# Altium project CtlQFP.PrjPcb (part 1 of 2)
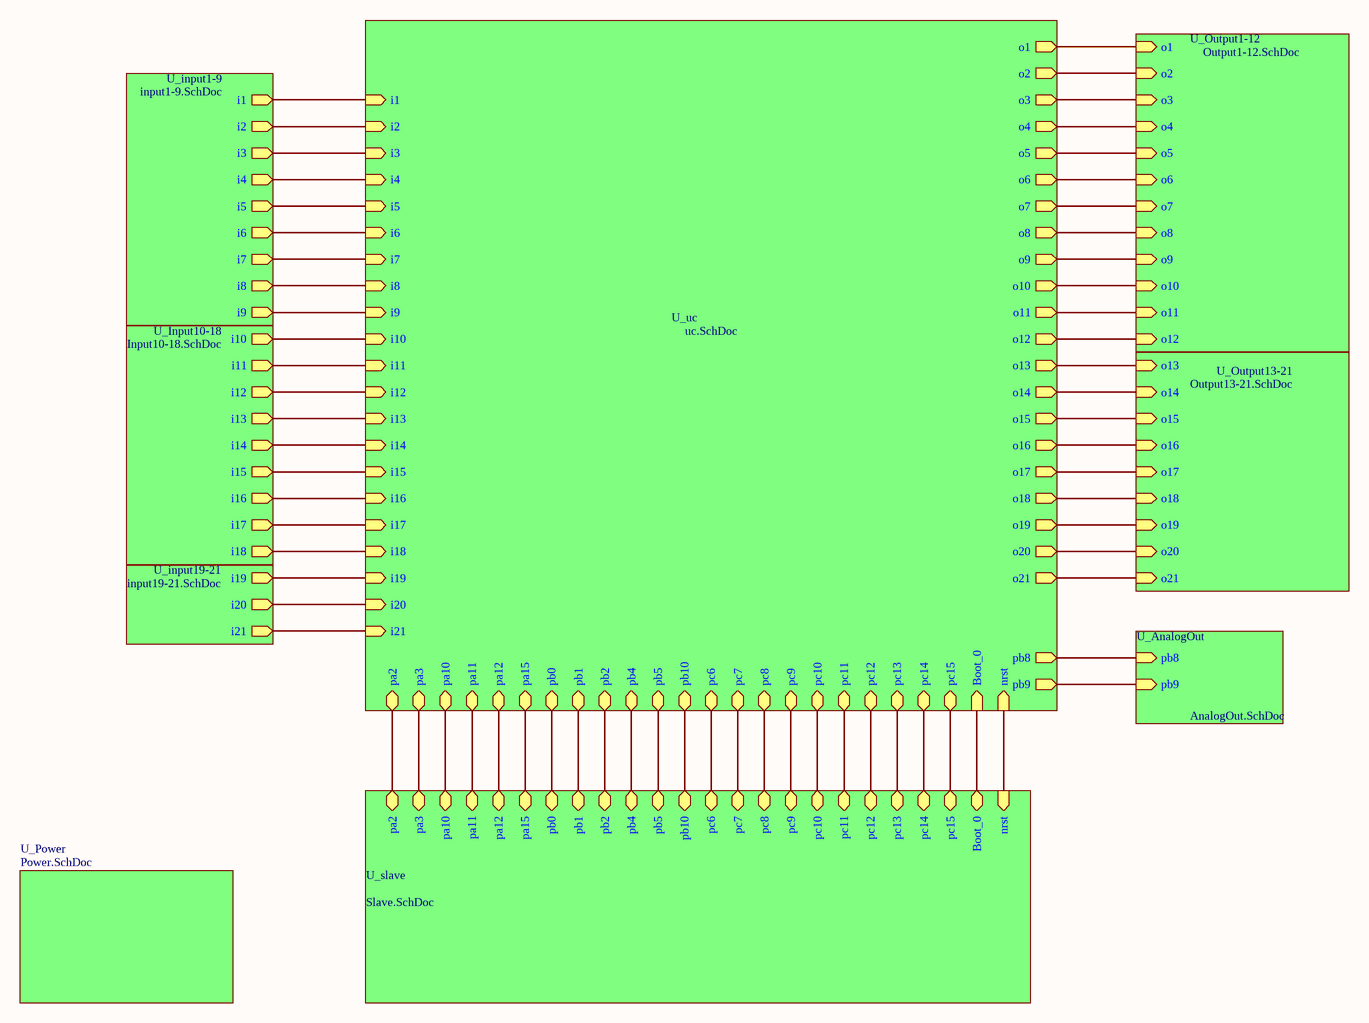
[diagram p0: Main.SchDoc]
10 sheets, 414 parts. Net scope: hierarchical (ports join the sheet entries above them; power ports are global).
Board file: QFP.PcbDoc
Sheets:
  Main.SchDoc
    U_input1-9 = input1-9.SchDoc
    U_Input10-18 = Input10-18.SchDoc
    U_input19-21 = input19-21.SchDoc
    U_AnalogOut = AnalogOut.SchDoc
    U_slave = slave.SchDoc
    U_uc = uc.SchDoc
    U_Power = Power.SchDoc
    U_Output1-12 = Output1-12.SchDoc
    U_Output13-21 = Output13-21.SchDoc

## Sheet Main.SchDoc
size 420 x 297 mm; Revision: 0; SheetNumber: 1; SheetTotal: 10; Номер листа: 1; Общее количество листов: 10; Наименование изделия 1: QFP Main; Наименование изделия 2: Схема электрическая; Наименование изделия 3: принципиальная

### Sub-sheets
U_AnalogOut = AnalogOut.SchDoc: pb8 (in), pb9 (in)
U_input1-9 = input1-9.SchDoc: i2 (out), i3 (out), i1 (out), i5 (out), i6 (out), i4 (out), i8 (out), i9 (out), i7 (out)
U_Input10-18 = Input10-18.SchDoc: i17 (out), i18 (out), i16 (out), i14 (out), i15 (out), i13 (out), i11 (out), i12 (out), i10 (out)
U_input19-21 = input19-21.SchDoc: i20 (out), i21 (out), i19 (out)
U_Output1-12 = Output1-12.SchDoc: o1 (in), o2 (in), o3 (in), o4 (in), o5 (in), o6 (in), o7 (in), o8 (in), o9 (in), o10 (in), o11 (in), o12 (in)
U_Output13-21 = Output13-21.SchDoc: o13 (in), o14 (in), o15 (in), o16 (in), o17 (in), o18 (in), o19 (in), o20 (in), o21 (in)
U_Power = Power.SchDoc: no entries
U_slave = Slave.SchDoc: pa10 (bidir), pa11 (bidir), pa12 (bidir), pa15 (bidir), pb0 (bidir), pb1 (bidir), pb2 (bidir), pb4 (bidir), pb5 (bidir), pb10 (bidir), pс6 (bidir), pс7 (bidir), pс8 (bidir), pс9 (bidir), pс10 (bidir), pс11 (bidir), pс12 (bidir), pс13 (bidir), pс14 (bidir), pс15 (bidir), Вооt_0 (bidir), nrst (in), pa3 (bidir), pa2 (bidir)
U_uc = uc.SchDoc: Вооt_0 (in), nrst (in), i1 (in), i2 (in), i3 (in), i4 (in), i5 (in), i6 (in), i7 (in), i8 (in), i9 (in), i10 (in), i11 (in), i12 (in), i13 (in), i14 (in), i15 (in), i16 (in), i17 (in), i18 (in), i19 (in), i20 (in), i21 (in), pb8 (out), o2 (out), o3 (out), o4 (out), o5 (out), o6 (out), o7 (out), o8 (out), o9 (out), o10 (out), o11 (out), o12 (out), o13 (out), o14 (out), o15 (out), o16 (out), o17 (out), o18 (out), o19 (out), o20 (out), o21 (out), pa10 (bidir), pa11 (bidir), pa12 (bidir), pa15 (bidir), pb0 (bidir), pb1 (bidir), pb2 (bidir), pb4 (bidir), pb10 (bidir), pс6 (bidir), pс7 (bidir), pс8 (bidir), pс9 (bidir), pс10 (bidir), pс11 (bidir), pс12 (bidir), pс13 (bidir), pс14 (bidir), pс15 (bidir), pa3 (bidir), pa2 (bidir), pb9 (out), o1 (out), pb5 (bidir)

### Nets
nrst: sheet U_slave/nrst, sheet U_uc/nrst
NetDD1_10: sheet U_input1-9/i4, sheet U_uc/i4
NetDD1_12: sheet U_input1-9/i3, sheet U_uc/i3
NetDD1_14: sheet U_input1-9/i2, sheet U_uc/i2
NetDD1_16: sheet U_input1-9/i1, sheet U_uc/i1
NetDD2_10: sheet U_input1-9/i8, sheet U_uc/i8
NetDD2_12: sheet U_input1-9/i7, sheet U_uc/i7
NetDD2_14: sheet U_input1-9/i6, sheet U_uc/i6
NetDD2_16: sheet U_input1-9/i5, sheet U_uc/i5
NetDD3_10: sheet U_Input10-18/i12, sheet U_uc/i12
NetDD3_12: sheet U_Input10-18/i11, sheet U_uc/i11
NetDD3_14: sheet U_Input10-18/i10, sheet U_uc/i10
NetDD3_16: sheet U_input1-9/i9, sheet U_uc/i9
NetDD4_10: sheet U_Input10-18/i16, sheet U_uc/i16
NetDD4_12: sheet U_Input10-18/i15, sheet U_uc/i15
NetDD4_14: sheet U_Input10-18/i14, sheet U_uc/i14
NetDD4_16: sheet U_Input10-18/i13, sheet U_uc/i13
NetDD5_10: sheet U_input19-21/i20, sheet U_uc/i20
NetDD5_12: sheet U_input19-21/i19, sheet U_uc/i19
NetDD5_14: sheet U_Input10-18/i18, sheet U_uc/i18
NetDD5_16: sheet U_Input10-18/i17, sheet U_uc/i17
NetDD6_1: sheet U_uc/o1, sheet U_Output1-12/o1
NetDD6_2: sheet U_uc/o2, sheet U_Output1-12/o2
NetDD6_3: sheet U_uc/o3, sheet U_Output1-12/o3
NetDD6_4: sheet U_uc/o4, sheet U_Output1-12/o4
NetDD6_5: sheet U_uc/o5, sheet U_Output1-12/o5
NetDD6_6: sheet U_uc/o6, sheet U_Output1-12/o6
NetDD6_7: sheet U_uc/o7, sheet U_Output1-12/o7
NetDD6_8: sheet U_uc/o8, sheet U_Output1-12/o8
NetDD7_1: sheet U_uc/o9, sheet U_Output1-12/o9
NetDD7_2: sheet U_uc/o10, sheet U_Output1-12/o10
NetDD7_3: sheet U_uc/o11, sheet U_Output1-12/o11
NetDD7_4: sheet U_uc/o12, sheet U_Output1-12/o12
NetDD7_5: sheet U_uc/o13, sheet U_Output13-21/o13
NetDD7_6: sheet U_uc/o14, sheet U_Output13-21/o14
NetDD7_7: sheet U_uc/o15, sheet U_Output13-21/o15
NetDD7_8: sheet U_uc/o16, sheet U_Output13-21/o16
NetDD8_7: sheet U_slave/pс13, sheet U_uc/pс13
NetDD8_8: sheet U_slave/pс14, sheet U_uc/pс14
NetDD8_9: sheet U_slave/pс15, sheet U_uc/pс15
NetDD8_24: sheet U_uc/o17, sheet U_Output13-21/o17
NetDD8_25: sheet U_slave/pa2, sheet U_uc/pa2
NetDD8_26: sheet U_slave/pa3, sheet U_uc/pa3
NetDD8_31: sheet U_uc/o18, sheet U_Output13-21/o18
NetDD8_32: sheet U_uc/o19, sheet U_Output13-21/o19
NetDD8_34: sheet U_input19-21/i21, sheet U_uc/i21
NetDD8_35: sheet U_slave/pb0, sheet U_uc/pb0
NetDD8_36: sheet U_slave/pb1, sheet U_uc/pb1
NetDD8_37: sheet U_slave/pb2, sheet U_uc/pb2
NetDD8_47: sheet U_slave/pb10, sheet U_uc/pb10
NetDD8_63: sheet U_slave/pс6, sheet U_uc/pс6
NetDD8_64: sheet U_slave/pс7, sheet U_uc/pс7
NetDD8_65: sheet U_slave/pс8, sheet U_uc/pс8
NetDD8_66: sheet U_slave/pс9, sheet U_uc/pс9
NetDD8_67: sheet U_uc/o20, sheet U_Output13-21/o20
NetDD8_68: sheet U_uc/o21, sheet U_Output13-21/o21
NetDD8_69: sheet U_slave/pa10, sheet U_uc/pa10
NetDD8_70: sheet U_slave/pa11, sheet U_uc/pa11
NetDD8_71: sheet U_slave/pa12, sheet U_uc/pa12
NetDD8_77: sheet U_slave/pa15, sheet U_uc/pa15
NetDD8_78: sheet U_slave/pс10, sheet U_uc/pс10
NetDD8_79: sheet U_slave/pс11, sheet U_uc/pс11
NetDD8_80: sheet U_slave/pс12, sheet U_uc/pс12
NetDD8_90: sheet U_slave/pb4, sheet U_uc/pb4
NetDD8_91: sheet U_slave/pb5, sheet U_uc/pb5
NetDD8_94: sheet U_slave/Вооt_0, sheet U_uc/Вооt_0
NetDD8_95: sheet U_AnalogOut/pb8, sheet U_uc/pb8
NetDD8_96: sheet U_AnalogOut/pb9, sheet U_uc/pb9

### Notes on the sheet
- Перв. примен.
- Справ. №
- Подп. и дата
- Инв. № дубл.
- Взам. инв. №
- Разраб.
- Изм.
- Лист
- № докум.
- Подп.
- Дата
- Лит.
- Масса
- Масштаб
- Пров.
- Т.контр.
- Листов
- Инв. № подл.
- Утв.
- Н.контр.
- Копировал
- Формат А3

## Sheet input1-9.SchDoc
size 594 x 420 mm; Обозначение документа: QFP input1-9; Номер листа: 4; Общее количество листов: 9
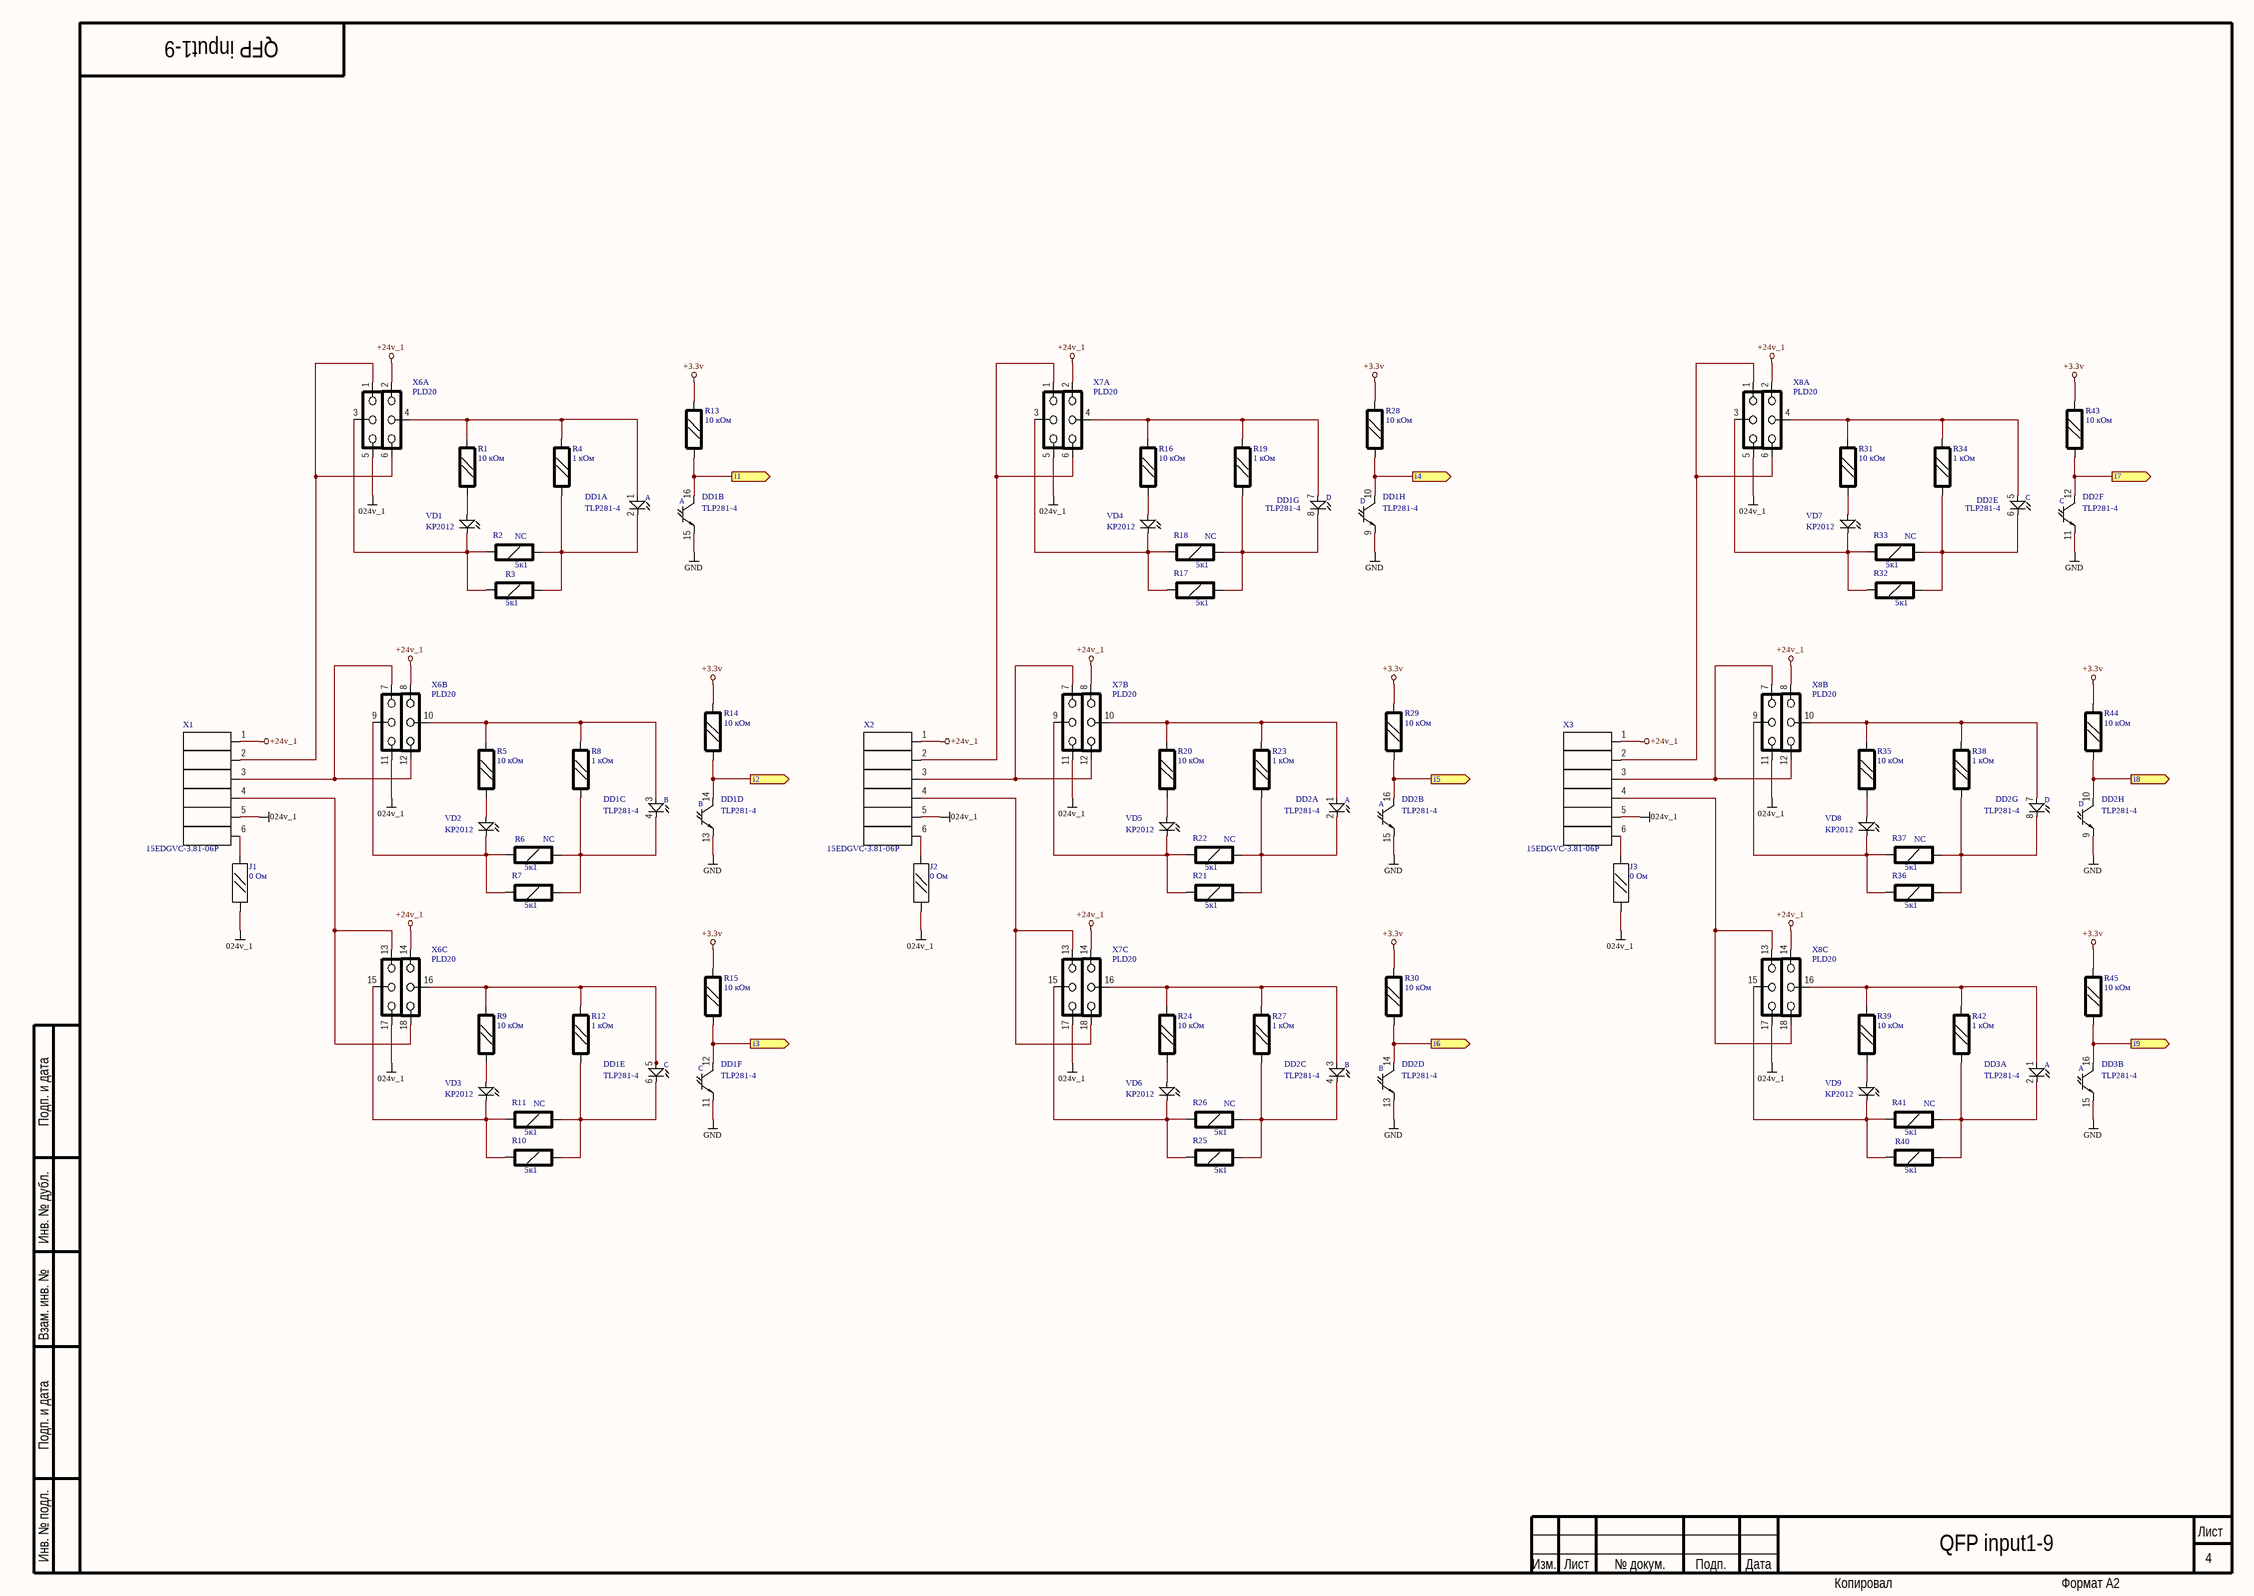
[diagram p1: input1-9.SchDoc]

### Parts
DD1  TLP281-4  [SO16]  (parts A,B,C,D,E,F,G,H of 8)
DD2  TLP281-4  [SO16]  (parts A,B,C,D,E,F,G,H of 8)
DD3  TLP281-4  [SO16]  (parts A,B of 8)
J1  0 Ом  [SMD0805RES]
J2  0 Ом  [SMD0805RES]
J3  0 Ом  [SMD0805RES]
R1  10 кОм  [SMD0805RES]
R2  5к1  SolderOpton: NC  [RES1206]
R3  5к1  [RES1206]
R4  1 кОм  [SMD0805RES]
R5  10 кОм  [SMD0805RES]
R6  5к1  SolderOpton: NC  [RES1206]
R7  5к1  [RES1206]
R8  1 кОм  [SMD0805RES]
R9  10 кОм  [SMD0805RES]
R10  5к1  [RES1206]
R11  5к1  SolderOpton: NC  [RES1206]
R12  1 кОм  [SMD0805RES]
R13  10 кОм  [SMD0805RES]
R14  10 кОм  [SMD0805RES]
R15  10 кОм  [SMD0805RES]
R16  10 кОм  [SMD0805RES]
R17  5к1  [RES1206]
R18  5к1  SolderOpton: NC  [RES1206]
R19  1 кОм  [SMD0805RES]
R20  10 кОм  [SMD0805RES]
R21  5к1  [RES1206]
R22  5к1  SolderOpton: NC  [RES1206]
R23  1 кОм  [SMD0805RES]
R24  10 кОм  [SMD0805RES]
R25  5к1  [RES1206]
R26  5к1  SolderOpton: NC  [RES1206]
R27  1 кОм  [SMD0805RES]
R28  10 кОм  [SMD0805RES]
R29  10 кОм  [SMD0805RES]
R30  10 кОм  [SMD0805RES]
R31  10 кОм  [SMD0805RES]
R32  5к1  [RES1206]
R33  5к1  SolderOpton: NC  [RES1206]
R34  1 кОм  [SMD0805RES]
R35  10 кОм  [SMD0805RES]
R36  5к1  [RES1206]
R37  5к1  SolderOpton: NC  [RES1206]
R38  1 кОм  [SMD0805RES]
R39  10 кОм  [SMD0805RES]
R40  5к1  [RES1206]
R41  5к1  SolderOpton: NC  [RES1206]
R42  1 кОм  [SMD0805RES]
R43  10 кОм  [SMD0805RES]
R44  10 кОм  [SMD0805RES]
R45  10 кОм  [SMD0805RES]
VD1  KP2012  [SMD0805DIO_C]
VD2  KP2012  [SMD0805DIO_C]
VD3  KP2012  [SMD0805DIO_C]
VD4  KP2012  [SMD0805DIO_C]
VD5  KP2012  [SMD0805DIO_C]
VD6  KP2012  [SMD0805DIO_C]
VD7  KP2012  [SMD0805DIO_C]
VD8  KP2012  [SMD0805DIO_C]
VD9  KP2012  [SMD0805DIO_C]
X1  15EDGVC-3.81-06P  [15EDGVC_081_6]
X2  15EDGVC-3.81-06P  [15EDGVC_081_6]
X3  15EDGVC-3.81-06P  [15EDGVC_081_6]
X6  PLD20  [pld2x10_1.27]  (parts A,B,C of 7)
X7  PLD20  [pld2x10_1.27]  (parts A,B,C of 7)
X8  PLD20  [pld2x10_1.27]  (parts A,B,C of 7)

### Ports
i1 (out), i2 (out), i3 (out), i4 (out), i5 (out), i6 (out), i7 (out), i8 (out), i9 (out)

### Nets
024v_1: J1.1 J2.2 J3.2 X1.5 X2.5 X3.5 X6.5 X6.11 X6.17 X7.5 X7.11 X7.17 X8.5 X8.11 X8.17
+3.3v: R13.2 R14.2 R15.2 R28.2 R29.2 R30.2 R43.2 R44.2 R45.2
+24v_1: X1.1 X2.1 X3.1 X6.2 X6.8 X6.14 X7.2 X7.8 X7.14 X8.2 X8.8 X8.14
GND: DD1.9(Emitter_D) DD1.11(Emitter_C) DD1.13(Emitter_B) DD1.15(Emitter_A) DD2.9(Emitter_D) DD2.11(Emitter_C) DD2.13(Emitter_B) DD2.15(Emitter_A) DD3.15(Emitter_A)
NetDD1_1: DD1.1(Anode_A) R1.1 R4.1 X6.4
NetDD1_2: DD1.2(Cathode_A) R2.2 R3.2 R4.2
NetDD1_3: DD1.3(Anode_B) R5.1 R8.1 X6.10
NetDD1_4: DD1.4(Cathode_B) R6.2 R7.2 R8.2
NetDD1_5: DD1.5(Anode_C) R9.1 R12.1 X6.16
NetDD1_6: DD1.6(Cathode) R10.2 R11.2 R12.2
NetDD1_7: DD1.7(Anode_D) R16.1 R19.1 X7.4
NetDD1_8: DD1.8(Cathode_D) R17.2 R18.2 R19.2
NetDD1_10: DD1.10(Collector_D) R28.1 ; port i4
NetDD1_12: DD1.12(Collector_C) R15.1 ; port i3
NetDD1_14: DD1.14(Collector_B) R14.1 ; port i2
NetDD1_16: DD1.16(Collector_A) R13.1 ; port i1
NetDD2_1: DD2.1(Anode_A) R20.1 R23.1 X7.10
NetDD2_2: DD2.2(Cathode_A) R21.2 R22.2 R23.2
NetDD2_3: DD2.3(Anode_B) R24.1 R27.1 X7.16
NetDD2_4: DD2.4(Cathode_B) R25.2 R26.2 R27.2
NetDD2_5: DD2.5(Anode_C) R31.1 R34.1 X8.4
NetDD2_6: DD2.6(Cathode) R32.2 R33.2 R34.2
NetDD2_7: DD2.7(Anode_D) R35.1 R38.1 X8.10
NetDD2_8: DD2.8(Cathode_D) R36.2 R37.2 R38.2
NetDD2_10: DD2.10(Collector_D) R44.1 ; port i8
NetDD2_12: DD2.12(Collector_C) R43.1 ; port i7
NetDD2_14: DD2.14(Collector_B) R30.1 ; port i6
NetDD2_16: DD2.16(Collector_A) R29.1 ; port i5
NetDD3_1: DD3.1(Anode_A) R39.1 R42.1 X8.16
NetDD3_2: DD3.2(Cathode_A) R40.2 R41.2 R42.2
NetDD3_16: DD3.16(Collector_A) R45.1 ; port i9
NetJ1_2: J1.2 X1.6
NetJ2_1: J2.1 X2.6
NetJ3_1: J3.1 X3.6
NetR1_2: R1.2 VD1.2(Anode)
NetR2_1: R2.1 R3.1 VD1.1(Cathode) X6.3
NetR5_2: R5.2 VD2.2(Anode)
NetR6_1: R6.1 R7.1 VD2.1(Cathode) X6.9
NetR9_2: R9.2 VD3.2(Anode)
NetR10_1: R10.1 R11.1 VD3.1(Cathode) X6.15
NetR16_2: R16.2 VD4.2(Anode)
NetR17_1: R17.1 R18.1 VD4.1(Cathode) X7.3
NetR20_2: R20.2 VD5.2(Anode)
NetR21_1: R21.1 R22.1 VD5.1(Cathode) X7.9
NetR24_2: R24.2 VD6.2(Anode)
NetR25_1: R25.1 R26.1 VD6.1(Cathode) X7.15
NetR31_2: R31.2 VD7.2(Anode)
NetR32_1: R32.1 R33.1 VD7.1(Cathode) X8.3
NetR35_2: R35.2 VD8.2(Anode)
NetR36_1: R36.1 R37.1 VD8.1(Cathode) X8.9
NetR39_2: R39.2 VD9.2(Anode)
NetR40_1: R40.1 R41.1 VD9.1(Cathode) X8.15
NetX1_2: X1.2 X6.1 X6.6
NetX1_3: X1.3 X6.7 X6.12
NetX1_4: X1.4 X6.13 X6.18
NetX2_2: X2.2 X7.1 X7.6
NetX2_3: X2.3 X7.7 X7.12
NetX2_4: X2.4 X7.13 X7.18
NetX3_2: X3.2 X8.1 X8.6
NetX3_3: X3.3 X8.7 X8.12
NetX3_4: X3.4 X8.13 X8.18

### Notes on the sheet
- Подп. и дата
- Инв. № дубл.
- Взам. инв. №
- Инв. № подл.
- Изм.
- Лист
- № докум.
- Подп.
- Дата
- Копировал
- Формат А2
- (in symbol TLP281-4, part A) A
- (in symbol TLP281-4, part B) A
- (in symbol TLP281-4, part C) B
- (in symbol TLP281-4, part D) B
- (in symbol TLP281-4, part E) C
- (in symbol TLP281-4, part F) C
- (in symbol TLP281-4, part G) D
- (in symbol TLP281-4, part H) D

### Library data of the parts
DD1-DD3 = TLP281-4: 4х канальная транзисторная оптопара; Vendor: Tosba; Voltage: 80V; SolderOptoin: Norm; Value: TLP281-4; Price: 250
J1-J3 = JR0805: SMD 0805 перемычка; SolderOption: Norm; Price: 2; Vendor: *; Value: 0 Ом
R1 R4 R5 R8 R9 R12-R16 R19 R20 R23 R24 R27-R31 R34 R35 R38 R39 R42-R45 = R0805: Чип резистор 0805; Vendor: Generic; Tolerance: 5%; SolderOpton: Norm; Price: 2
  R1 R5 R9 R13-R16 R20 R24 R28-R31 R35 R39 R43-R45: Value: 10 кОм
  R4 R8 R12 R19 R23 R27 R34 R38 R42: Value: 1 кОм
R2 R6 R11 R18 R22 R26 R33 R37 R41 = R1206: Чип резистор 1206; Vendor: Generic; Tolerance: 5%; Price: 2; Value: 5к1
R3 R7 R10 R17 R21 R25 R32 R36 R40 = R1206: Чип резистор 1206; Vendor: Generic; Tolerance: 5%; SolderOpton: Norm; Price: 2; Value: 5к1
VD1-VD9 = KP2012_C: Чип светодиод 0805; Vendor: KB; Color: Green; SolderOpton: Norm; Price: 20; Value: KP2012
X1-X3 = 15EDGVC-3.81-06P: Вилка  6/3.81; Vendor: Degson; Current: 8А; Voltage: 2кВ; Price: 50; Value: 15EDGVC-3.81-06P
X6-X8 = PLD20: Вилка  PLD 20/1.27; Vendor: Confly; SolderOption: Norm; Price: 10; Value: PLD20

## Sheet Input10-18.SchDoc
size 594 x 420 mm; SheetNumber: 5; SheetTotal: 9; Обозначение документа: QFP input10-18; Номер листа: 5; Общее количество листов: 9
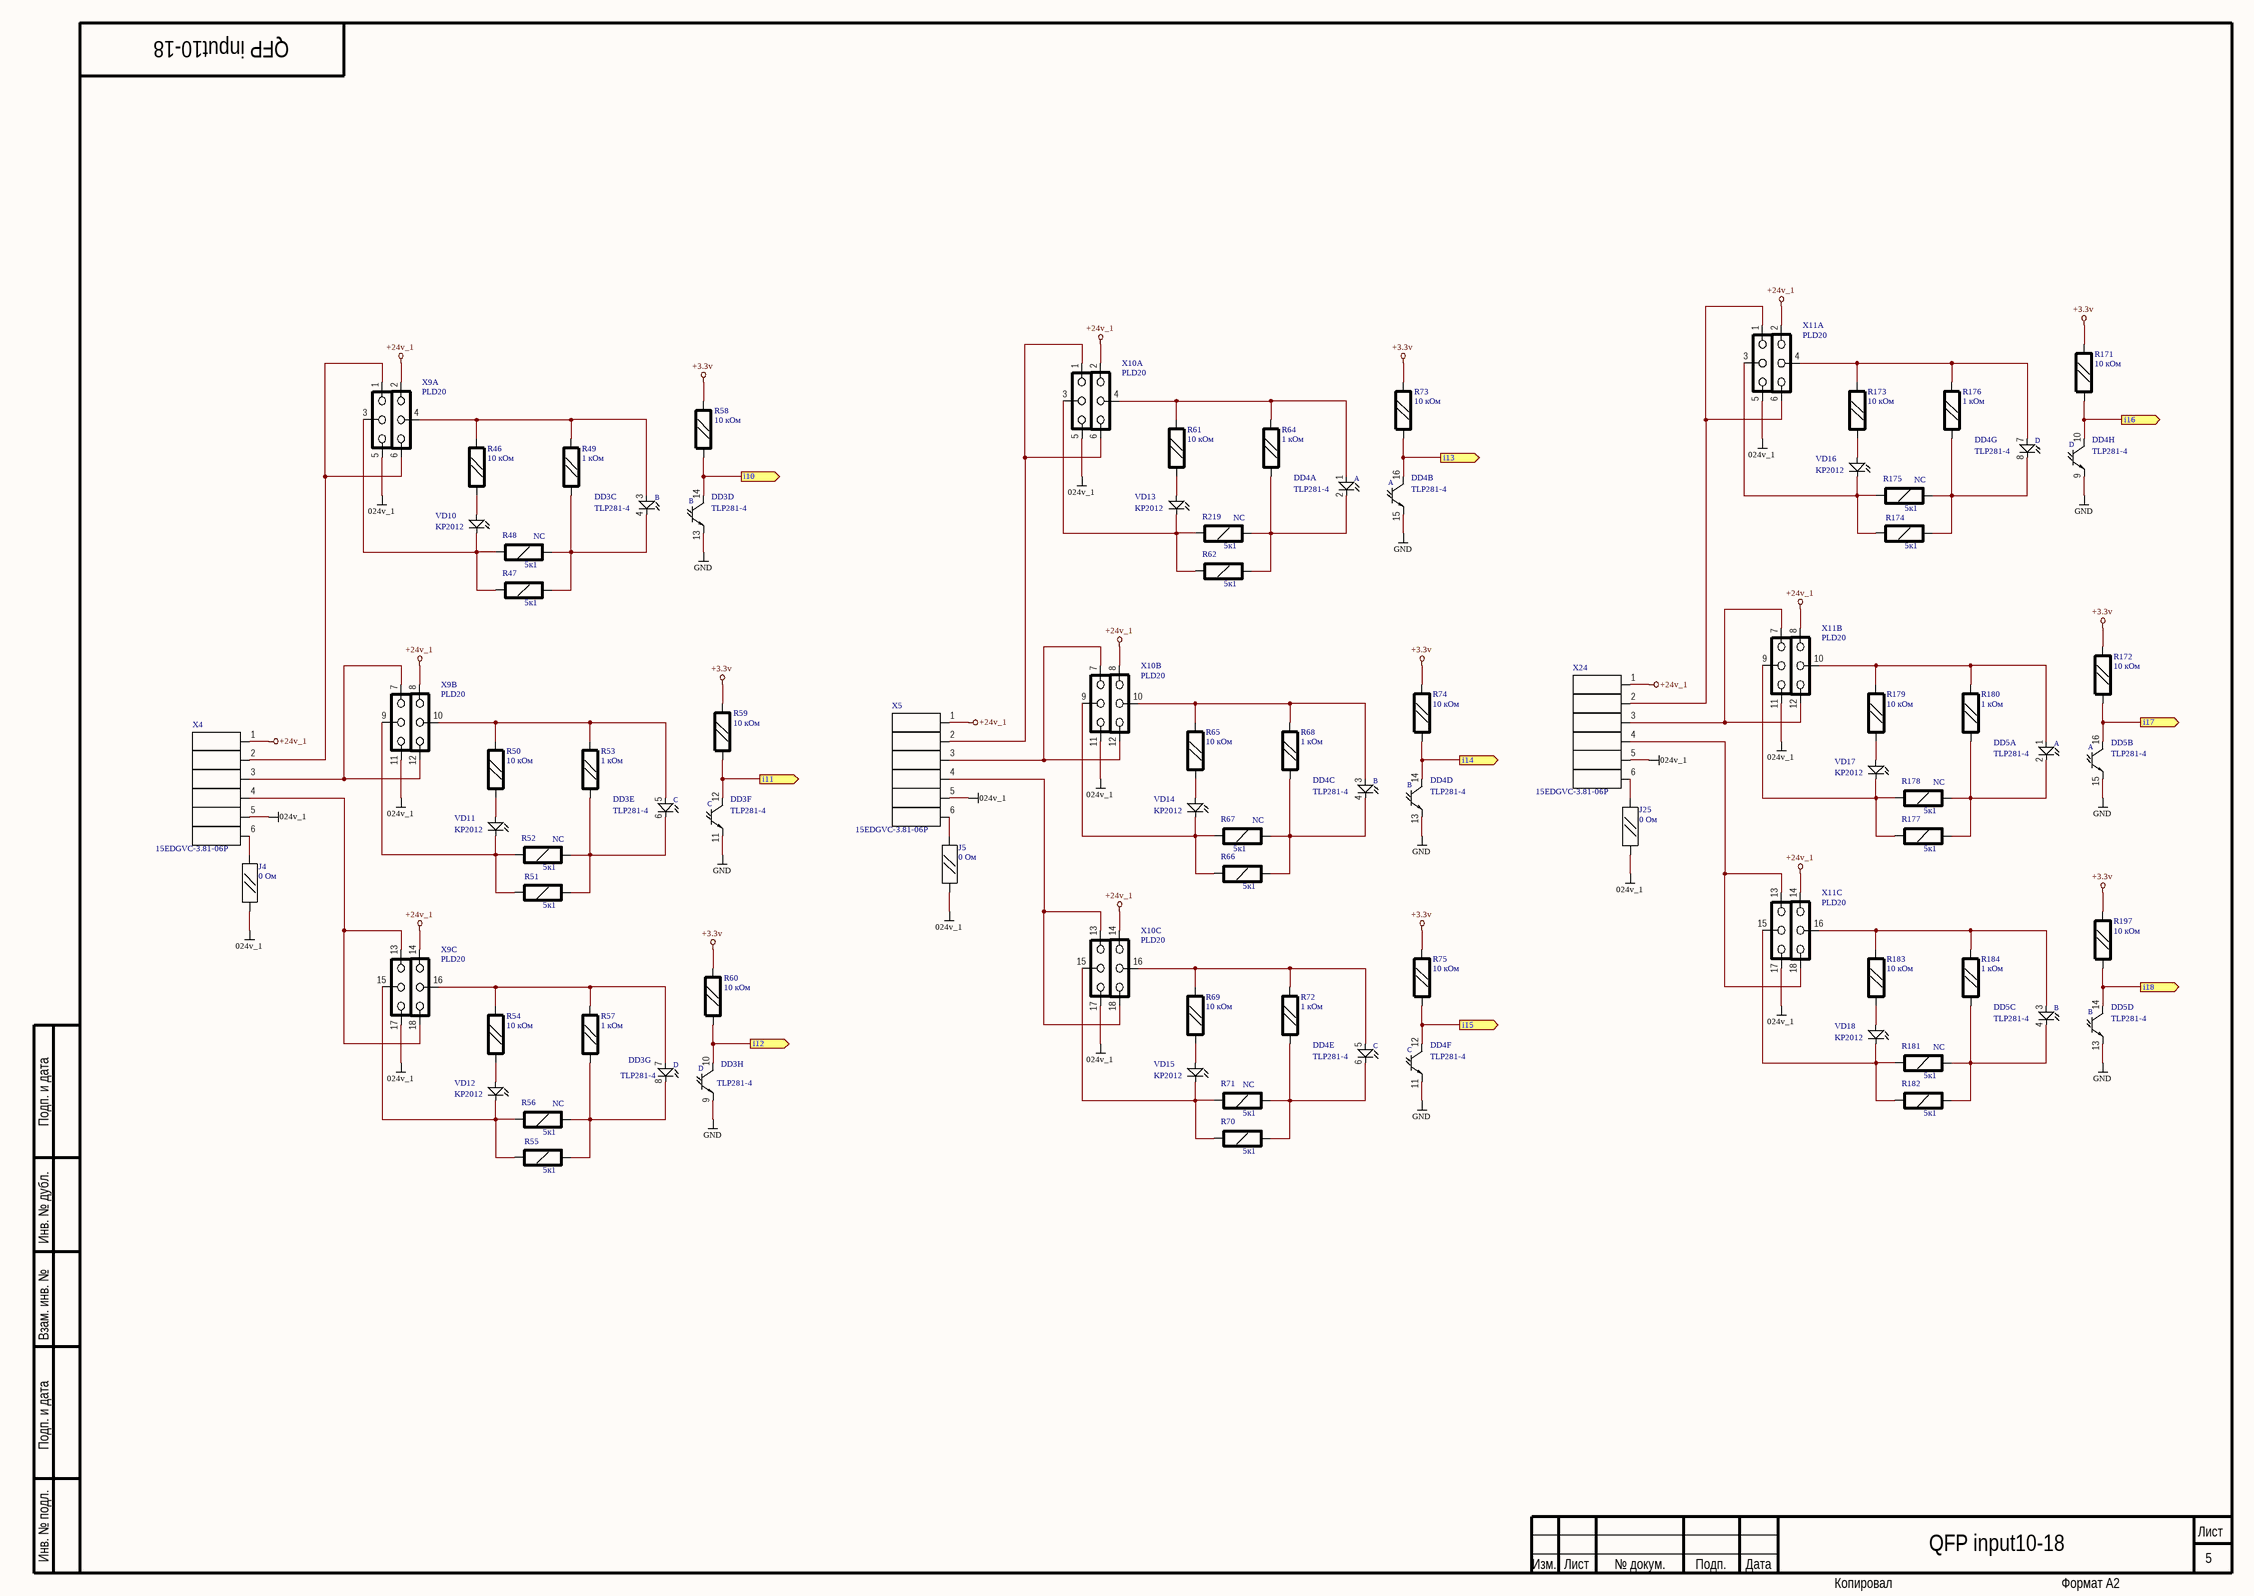
[diagram p2: Input10-18.SchDoc]

### Parts
DD3  TLP281-4  [SO16]  (parts C,D,E,F,G,H of 8)
DD4  TLP281-4  [SO16]  (parts A,B,C,D,E,F,G,H of 8)
DD5  TLP281-4  [SO16]  (parts A,B,C,D of 8)
J4  0 Ом  [SMD0805RES]
J5  0 Ом  [SMD0805RES]
J25  0 Ом  [SMD0805RES]
R46  10 кОм  [SMD0805RES]
R47  5к1  [RES1206]
R48  5к1  SolderOpton: NC  [RES1206]
R49  1 кОм  [SMD0805RES]
R50  10 кОм  [SMD0805RES]
R51  5к1  [RES1206]
R52  5к1  SolderOpton: NC  [RES1206]
R53  1 кОм  [SMD0805RES]
R54  10 кОм  [SMD0805RES]
R55  5к1  [RES1206]
R56  5к1  SolderOpton: NC  [RES1206]
R57  1 кОм  [SMD0805RES]
R58  10 кОм  [SMD0805RES]
R59  10 кОм  [SMD0805RES]
R60  10 кОм  [SMD0805RES]
R61  10 кОм  [SMD0805RES]
R62  5к1  [RES1206]
R64  1 кОм  [SMD0805RES]
R65  10 кОм  [SMD0805RES]
R66  5к1  [RES1206]
R67  5к1  SolderOpton: NC  [RES1206]
R68  1 кОм  [SMD0805RES]
R69  10 кОм  [SMD0805RES]
R70  5к1  [RES1206]
R71  5к1  SolderOpton: NC  [RES1206]
R72  1 кОм  [SMD0805RES]
R73  10 кОм  [SMD0805RES]
R74  10 кОм  [SMD0805RES]
R75  10 кОм  [SMD0805RES]
R171  10 кОм  [SMD0805RES]
R172  10 кОм  [SMD0805RES]
R173  10 кОм  [SMD0805RES]
R174  5к1  [RES1206]
R175  5к1  SolderOpton: NC  [RES1206]
R176  1 кОм  [SMD0805RES]
R177  5к1  [RES1206]
R178  5к1  SolderOpton: NC  [RES1206]
R179  10 кОм  [SMD0805RES]
R180  1 кОм  [SMD0805RES]
R181  5к1  SolderOpton: NC  [RES1206]
R182  5к1  [RES1206]
R183  10 кОм  [SMD0805RES]
R184  1 кОм  [SMD0805RES]
R197  10 кОм  [SMD0805RES]
R219  5к1  SolderOpton: NC  [RES1206]
VD10  KP2012  [SMD0805DIO_C]
VD11  KP2012  [SMD0805DIO_C]
VD12  KP2012  [SMD0805DIO_C]
VD13  KP2012  [SMD0805DIO_C]
VD14  KP2012  [SMD0805DIO_C]
VD15  KP2012  [SMD0805DIO_C]
VD16  KP2012  [SMD0805DIO_C]
VD17  KP2012  [SMD0805DIO_C]
VD18  KP2012  [SMD0805DIO_C]
X4  15EDGVC-3.81-06P  [15EDGVC_081_6]
X5  15EDGVC-3.81-06P  [15EDGVC_081_6]
X9  PLD20  [pld2x10_1.27]  (parts A,B,C of 7)
X10  PLD20  [pld2x10_1.27]  (parts A,B,C of 7)
X11  PLD20  [pld2x10_1.27]  (parts A,B,C of 7)
X24  15EDGVC-3.81-06P  [15EDGVC_081_6]

### Ports
i10 (out), i11 (out), i12 (out), i13 (out), i14 (out), i15 (out), i16 (out), i17 (out), i18 (out)

### Nets
024v_1: J4.2 J5.2 J25.2 X4.5 X5.5 X9.5 X9.11 X9.17 X10.5 X10.11 X10.17 X11.5 X11.11 X11.17 X24.5
+3.3v: R58.2 R59.2 R60.2 R73.2 R74.2 R75.2 R171.2 R172.2 R197.2
+24v_1: X4.1 X5.1 X9.2 X9.8 X9.14 X10.2 X10.8 X10.14 X11.2 X11.8 X11.14 X24.1
GND: DD3.9(Emitter_D) DD3.11(Emitter_C) DD3.13(Emitter_B) DD4.9(Emitter_D) DD4.11(Emitter_C) DD4.13(Emitter_B) DD4.15(Emitter_A) DD5.13(Emitter_B) DD5.15(Emitter_A)
NetDD3_3: DD3.3(Anode_B) R46.1 R49.1 X9.4
NetDD3_4: DD3.4(Cathode_B) R47.2 R48.2 R49.2
NetDD3_5: DD3.5(Anode_C) R50.1 R53.1 X9.10
NetDD3_6: DD3.6(Cathode) R51.2 R52.2 R53.2
NetDD3_7: DD3.7(Anode_D) R54.1 R57.1 X9.16
NetDD3_8: DD3.8(Cathode_D) R55.2 R56.2 R57.2
NetDD3_10: DD3.10(Collector_D) R60.1 ; port i12
NetDD3_12: DD3.12(Collector_C) R59.1 ; port i11
NetDD3_14: DD3.14(Collector_B) R58.1 ; port i10
NetDD4_1: DD4.1(Anode_A) R61.1 R64.1 X10.4
NetDD4_2: DD4.2(Cathode_A) R62.2 R64.2 R219.2
NetDD4_3: DD4.3(Anode_B) R65.1 R68.1 X10.10
NetDD4_4: DD4.4(Cathode_B) R66.2 R67.2 R68.2
NetDD4_5: DD4.5(Anode_C) R69.1 R72.1 X10.16
NetDD4_6: DD4.6(Cathode) R70.2 R71.2 R72.2
NetDD4_7: DD4.7(Anode_D) R173.1 R176.1 X11.4
NetDD4_8: DD4.8(Cathode_D) R174.2 R175.2 R176.2
NetDD4_10: DD4.10(Collector_D) R171.1 ; port i16
NetDD4_12: DD4.12(Collector_C) R75.1 ; port i15
NetDD4_14: DD4.14(Collector_B) R74.1 ; port i14
NetDD4_16: DD4.16(Collector_A) R73.1 ; port i13
NetDD5_1: DD5.1(Anode_A) R179.1 R180.1 X11.10
NetDD5_2: DD5.2(Cathode_A) R177.2 R178.2 R180.2
NetDD5_3: DD5.3(Anode_B) R183.1 R184.1 X11.16
NetDD5_4: DD5.4(Cathode_B) R181.2 R182.2 R184.2
NetDD5_14: DD5.14(Collector_B) R197.1 ; port i18
NetDD5_16: DD5.16(Collector_A) R172.1 ; port i17
NetJ4_1: J4.1 X4.6
NetJ5_1: J5.1 X5.6
NetJ25_1: J25.1 X24.6
NetR46_2: R46.2 VD10.2(Anode)
NetR47_1: R47.1 R48.1 VD10.1(Cathode) X9.3
NetR50_2: R50.2 VD11.2(Anode)
NetR51_1: R51.1 R52.1 VD11.1(Cathode) X9.9
NetR54_2: R54.2 VD12.2(Anode)
NetR55_1: R55.1 R56.1 VD12.1(Cathode) X9.15
NetR61_2: R61.2 VD13.2(Anode)
NetR62_1: R62.1 R219.1 VD13.1(Cathode) X10.3
NetR65_2: R65.2 VD14.2(Anode)
NetR66_1: R66.1 R67.1 VD14.1(Cathode) X10.9
NetR69_2: R69.2 VD15.2(Anode)
NetR70_1: R70.1 R71.1 VD15.1(Cathode) X10.15
NetR173_2: R173.2 VD16.2(Anode)
NetR174_1: R174.1 R175.1 VD16.1(Cathode) X11.3
NetR177_1: R177.1 R178.1 VD17.1(Cathode) X11.9
NetR179_2: R179.2 VD17.2(Anode)
NetR181_1: R181.1 R182.1 VD18.1(Cathode) X11.15
NetR183_2: R183.2 VD18.2(Anode)
NetX4_2: X4.2 X9.1 X9.6
NetX4_3: X4.3 X9.7 X9.12
NetX4_4: X4.4 X9.13 X9.18
NetX5_2: X5.2 X10.1 X10.6
NetX5_3: X5.3 X10.7 X10.12
NetX5_4: X5.4 X10.13 X10.18
NetX11_1: X11.1 X11.6 X24.2
NetX11_7: X11.7 X11.12 X24.3
NetX11_13: X11.13 X11.18 X24.4

### Notes on the sheet
- Подп. и дата
- Инв. № дубл.
- Взам. инв. №
- Инв. № подл.
- Изм.
- Лист
- № докум.
- Подп.
- Дата
- Копировал
- Формат А2
- (in symbol TLP281-4, part A) A
- (in symbol TLP281-4, part B) A
- (in symbol TLP281-4, part C) B
- (in symbol TLP281-4, part D) B
- (in symbol TLP281-4, part E) C
- (in symbol TLP281-4, part F) C
- (in symbol TLP281-4, part G) D
- (in symbol TLP281-4, part H) D

### Library data of the parts
DD3-DD5 = TLP281-4: as DD1 on sheet input1-9; Value: TLP281-4; Price: 250
J4 J5 J25 = JR0805: SMD 0805 перемычка; SolderOption: Norm; Price: 2; Vendor: *; Value: 0 Ом
R46 R49 R50 R53 R54 R57-R61 R64 R65 R68 R69 R72-R75 R171-R173 R176 R179 R180 R183 R184 R197 = R0805: as R1 on sheet input1-9; Price: 2
  R46 R50 R54 R58-R61 R65 R69 R73-R75 R171-R173 R179 R183 R197: Value: 10 кОм
  R49 R53 R57 R64 R68 R72 R176 R180 R184: Value: 1 кОм
R47 R51 R55 R62 R66 R70 R174 R177 R182 = R1206: as R3 on sheet input1-9; Price: 2; Value: 5к1
R48 R52 R56 R67 R71 R175 R178 R181 R219 = R1206: as R2 on sheet input1-9; Price: 2; Value: 5к1
VD10-VD18 = KP2012_C: as VD1 on sheet input1-9; Price: 20; Value: KP2012
X4 X5 X24 = 15EDGVC-3.81-06P: as X1 on sheet input1-9; Price: 50; Value: 15EDGVC-3.81-06P
X9-X11 = PLD20: as X6 on sheet input1-9; Price: 10; Value: PLD20

## Sheet input19-21.SchDoc
size 420 x 297 mm; Обозначение документа: QFP input19-21; Номер листа: 6; Общее количество листов: 9
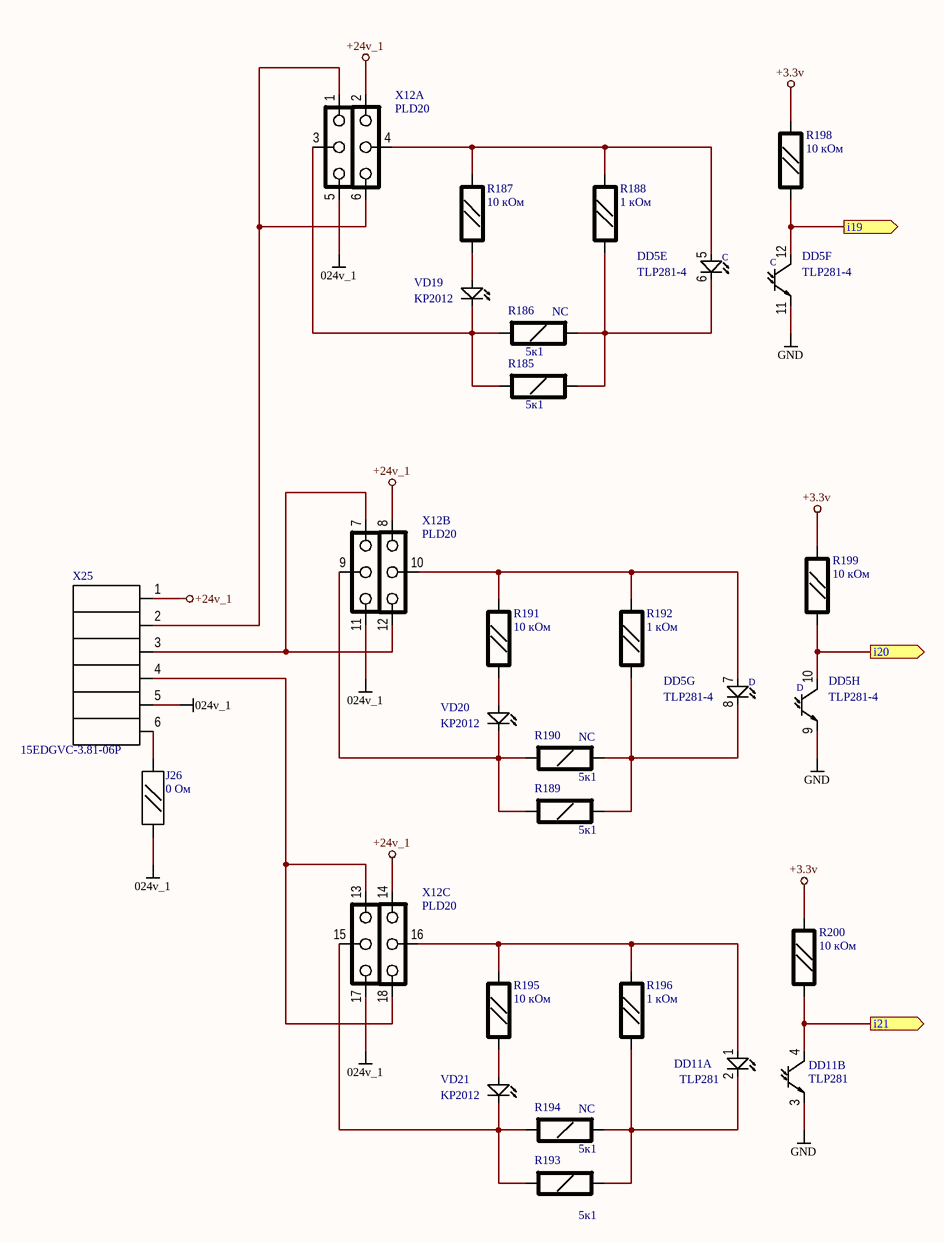
[diagram p3: input19-21.SchDoc]

### Parts
DD5  TLP281-4  [SO16]  (parts E,F,G,H of 8)
DD11  TLP281  [SOIC4]  (parts A,B of 2)
J26  0 Ом  [SMD0805RES]
R185  5к1  [RES1206]
R186  5к1  SolderOpton: NC  [RES1206]
R187  10 кОм  [SMD0805RES]
R188  1 кОм  [SMD0805RES]
R189  5к1  [RES1206]
R190  5к1  SolderOpton: NC  [RES1206]
R191  10 кОм  [SMD0805RES]
R192  1 кОм  [SMD0805RES]
R193  5к1  [RES1206]
R194  5к1  SolderOpton: NC  [RES1206]
R195  10 кОм  [SMD0805RES]
R196  1 кОм  [SMD0805RES]
R198  10 кОм  [SMD0805RES]
R199  10 кОм  [SMD0805RES]
R200  10 кОм  [SMD0805RES]
VD19  KP2012  [SMD0805DIO_C]
VD20  KP2012  [SMD0805DIO_C]
VD21  KP2012  [SMD0805DIO_C]
X12  PLD20  [pld2x10_1.27]  (parts A,B,C of 7)
X25  15EDGVC-3.81-06P  [15EDGVC_081_6]

### Ports
i19 (out), i20 (out), i21 (out)

### Nets
024v_1: J26.2 X12.5 X12.11 X12.17 X25.5
+3.3v: R198.2 R199.2 R200.2
+24v_1: X12.2 X12.8 X12.14 X25.1
GND: DD5.9(Emitter_D) DD5.11(Emitter_C) DD11.3(Emitter)
NetDD5_5: DD5.5(Anode_C) R187.1 R188.1 X12.4
NetDD5_6: DD5.6(Cathode) R185.2 R186.2 R188.2
NetDD5_7: DD5.7(Anode_D) R191.1 R192.1 X12.10
NetDD5_8: DD5.8(Cathode_D) R189.2 R190.2 R192.2
NetDD5_10: DD5.10(Collector_D) R199.1 ; port i20
NetDD5_12: DD5.12(Collector_C) R198.1 ; port i19
NetDD8_34: DD11.4(Collector) R200.1 ; port i21
NetDD11_1: DD11.1(Anode) R195.1 R196.1 X12.16
NetDD11_2: DD11.2(Cathode) R193.2 R194.2 R196.2
NetJ26_1: J26.1 X25.6
NetR185_1: R185.1 R186.1 VD19.1(Cathode) X12.3
NetR187_2: R187.2 VD19.2(Anode)
NetR189_1: R189.1 R190.1 VD20.1(Cathode) X12.9
NetR191_2: R191.2 VD20.2(Anode)
NetR193_1: R193.1 R194.1 VD21.1(Cathode) X12.15
NetR195_2: R195.2 VD21.2(Anode)
NetX12_1: X12.1 X12.6 X25.2
NetX12_7: X12.7 X12.12 X25.3
NetX12_13: X12.13 X12.18 X25.4

### Notes on the sheet
- Подп. и дата
- Инв. № дубл.
- Взам. инв. №
- Инв. № подл.
- Изм.
- Лист
- № докум.
- Подп.
- Дата
- Копировал
- Формат А3
- (in symbol TLP281-4, part E) C
- (in symbol TLP281-4, part F) C
- (in symbol TLP281-4, part G) D
- (in symbol TLP281-4, part H) D

### Library data of the parts
DD5 = TLP281-4: as DD1 on sheet input1-9; Value: TLP281-4; Price: 250
DD11 = TLP281: Оптопара транзисторная; Vendor: Tosba; Voltage: 80V; SolderOption: Norm; Value: TLP281; Price: 150
J26 = JR0805: SMD 0805 перемычка; SolderOption: Norm; Price: 2; Vendor: *; Value: 0 Ом
R185 R189 R193 = R1206: as R3 on sheet input1-9; Price: 2; Value: 5к1
R186 R190 R194 = R1206: as R2 on sheet input1-9; Price: 2; Value: 5к1
R187 R188 R191 R192 R195 R196 R198-R200 = R0805: as R1 on sheet input1-9; Price: 2
  R187 R191 R195 R198-R200: Value: 10 кОм
  R188 R192 R196: Value: 1 кОм
VD19-VD21 = KP2012_C: as VD1 on sheet input1-9; Price: 20; Value: KP2012
X12 = PLD20: as X6 on sheet input1-9; Price: 10; Value: PLD20
X25 = 15EDGVC-3.81-06P: as X1 on sheet input1-9; Price: 50; Value: 15EDGVC-3.81-06P

## Sheet AnalogOut.SchDoc
size 420 x 297 mm; Обозначение документа: QFP analogOut; Номер листа: 9; Общее количество листов: 10
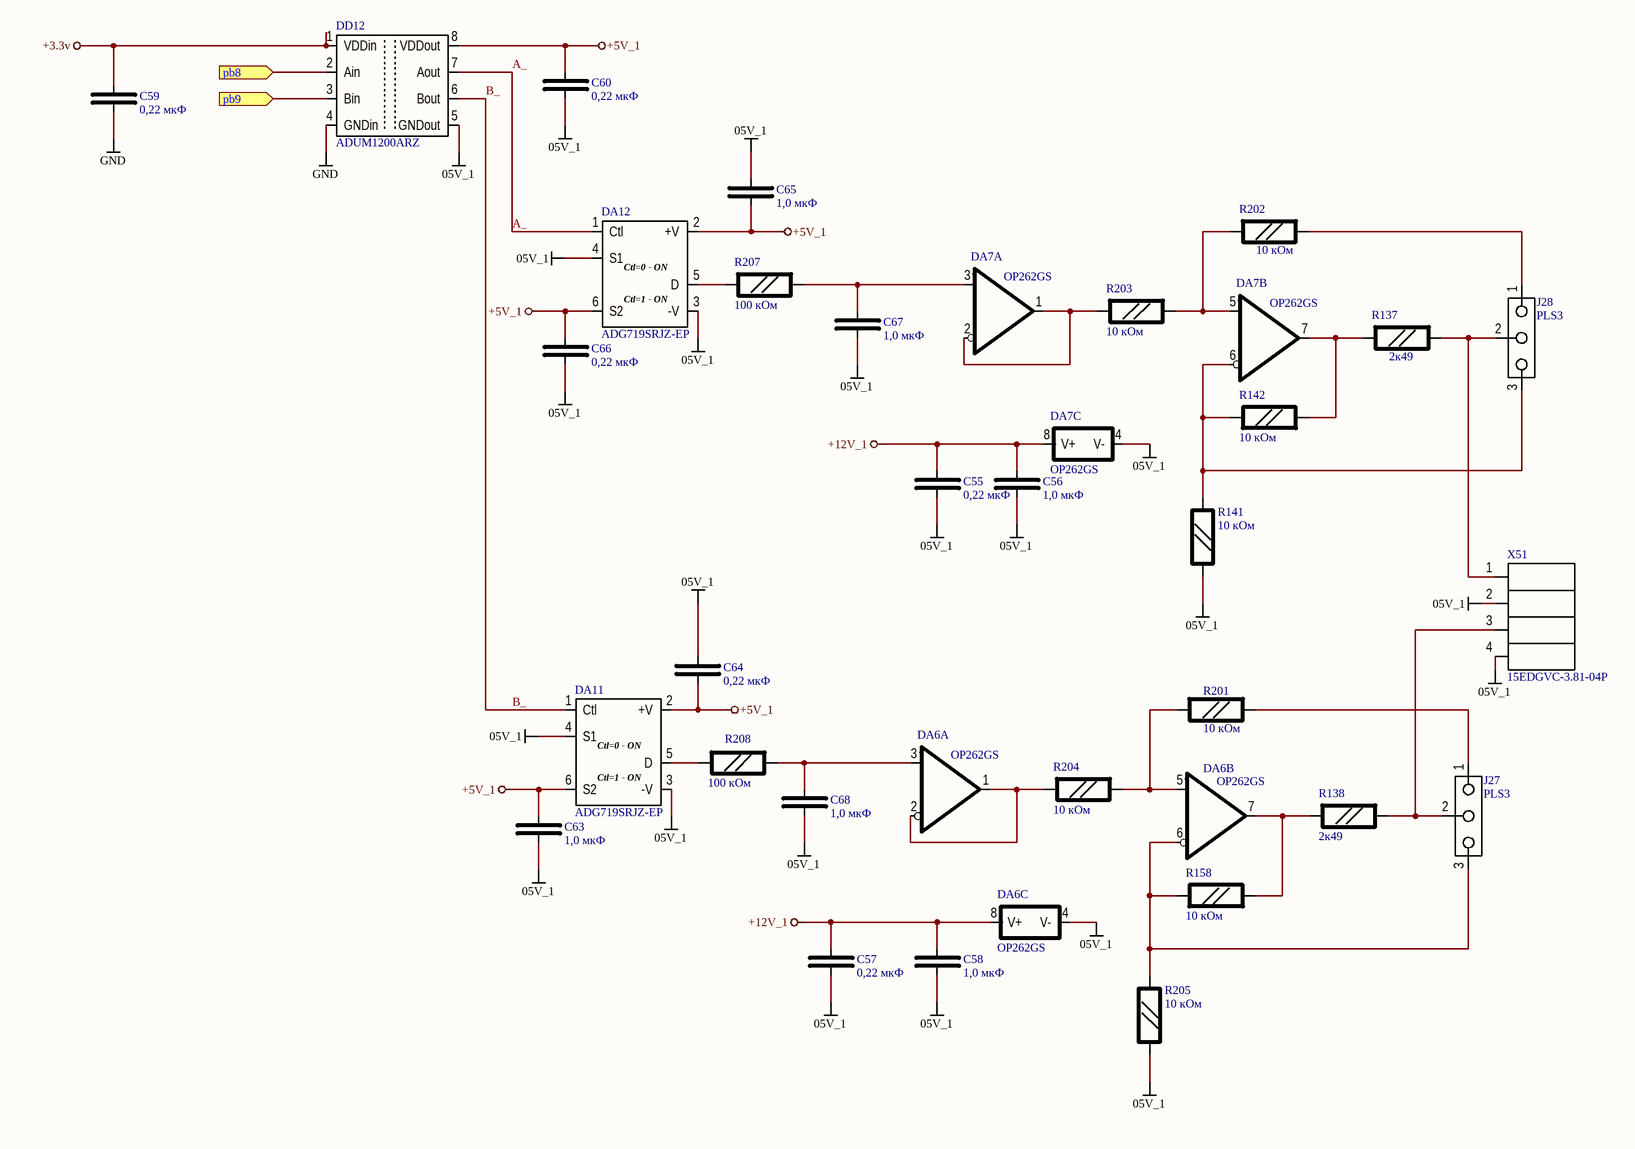
[diagram p4: AnalogOut.SchDoc]

### Parts
C55  0,22 мкФ  [SMD0805CAP]
C56  1,0 мкФ  [SMD0805CAP]
C57  0,22 мкФ  [SMD0805CAP]
C58  1,0 мкФ  [SMD0805CAP]
C59  0,22 мкФ  [SMD0805CAP]
C60  0,22 мкФ  [SMD0805CAP]
C63  1,0 мкФ  [SMD0805CAP]
C64  0,22 мкФ  [SMD0805CAP]
C65  1,0 мкФ  [SMD0805CAP]
C66  0,22 мкФ  [SMD0805CAP]
C67  1,0 мкФ  [SMD0805CAP]
C68  1,0 мкФ  [SMD0805CAP]
DA6  OP262GS  [SO8]  (parts A,B,C of 3)
DA7  OP262GS  [SO8]  (parts A,B,C of 3)
DA11  ADG719SRJZ-EP  [SOT23-6]
DA12  ADG719SRJZ-EP  [SOT23-6]
DD12  ADUM1200ARZ  [SO8]
J27  PLS3  [HDR1X3]
J28  PLS3  [HDR1X3]
R137  2к49  [SMD0805RES]
R138  2к49  [SMD0805RES]
R141  10 кОм  [SMD0805RES]
R142  10 кОм  [SMD0805RES]
R158  10 кОм  [SMD0805RES]
R201  10 кОм  [SMD0805RES]
R202  10 кОм  [SMD0805RES]
R203  10 кОм  [SMD0805RES]
R204  10 кОм  [SMD0805RES]
R205  10 кОм  [SMD0805RES]
R207  100 кОм  [SMD0805RES]
R208  100 кОм  [SMD0805RES]
X51  15EDGVC-3.81-04P  [15EDGVC_081_4]

### Ports
pb8 (in), pb9 (in)

### Nets
05V_1: C55.2 C56.2 C57.2 C58.2 C60.2 C63.2 C64.2 C65.2 C66.2 C67.2 C68.2 DA6.4(V-) DA7.4(V-) DA11.3(-V) DA11.4(S1) DA12.3(-V) DA12.4(S1) DD12.5(GNDout) R141.1 R205.1 X51.2 X51.4
+3.3v: C59.1 DD12.1(VDDin)
+5V_1: C60.1 C63.1 C64.1 C65.1 C66.1 DA11.2(+V) DA11.6(S2) DA12.2(+V) DA12.6(S2) DD12.8(VDDout)
+12V_1: C55.1 C56.1 C57.1 C58.1 DA6.8(V+) DA7.8(V+)
GND: C59.2 DD12.4(GNDin)
A_: DA12.1(Ctl) DD12.7(Aout)
B_: DA11.1(Ctl) DD12.6(Bout)
NetC67_1: C67.1 DA7.3(+) R207.2
NetC68_1: C68.1 DA6.3(+) R208.2
NetDA6_1: DA6.1(OUT) DA6.2(-) R204.1
NetDA6_5: DA6.5(+) R201.1 R204.2
NetDA6_6: DA6.6(-) J27.3(Left) R158.2 R205.2
NetDA6_7: DA6.7(OUT) R138.1 R158.1
NetDA7_1: DA7.1(OUT) DA7.2(-) R203.1
NetDA7_5: DA7.5(+) R202.1 R203.2
NetDA7_6: DA7.6(-) J28.3(Left) R141.2 R142.2
NetDA7_7: DA7.7(OUT) R137.1 R142.1
NetDA11_5: DA11.5(D) R208.1
NetDA12_5: DA12.5(D) R207.1
NetDD8_95: DD12.2(Ain) ; port pb8
NetDD8_96: DD12.3(Bin) ; port pb9
NetJ27_1: J27.1(Right) R201.2
NetJ27_2: J27.2(Cetnter) R138.2 X51.3
NetJ28_1: J28.1(Right) R202.2
NetJ28_2: J28.2(Cetnter) R137.2 X51.1

### Notes on the sheet
- Подп. и дата
- Инв. № дубл.
- Взам. инв. №
- Инв. № подл.
- Изм.
- Лист
- № докум.
- Подп.
- Дата
- Копировал
- Формат А3
- (in symbol ADG719BRJ) Ctl=0 - ON; Ctl=1 - ON

### Library data of the parts
C55-C60 C63-C68 = C0805: Чип конденсатор 0805; Voltage: 50V; Vendor: Generic; Temp: Y5V; Tol: 20%; SolderOpton: Norm; Price: 2
  C55 C57 C59 C60 C64 C66: Value: 0,22 мкФ
  C56 C58 C63 C65 C67 C68: Value: 1,0 мкФ
DA6 DA7 = OP262GS: ОУ сдвоенный R2R out; Vendor: Analog Devices; Voltage: 2.7..12V; Bandwidth: 15MHz; SolderOption: Norm; Value: OP262GS; Price: 400
DA11 DA12 = ADG719BRJ: аналоговый ключ SPDT; Vendor: Anlog Devices; Voltage: 1V8.. 5V5; SolderOption: Norm; Value: ADG719SRJZ-EP; Price: 500
DD12 = ADUM1200ARZ: 2х канальный цифровой изолятор; Vendor: Analog Devices; Voltage: 3..5V; SolderOpton: Norm; Value: ADUM1200ARZ; Price: 750
J27 J28 = PLS3: Джампер PLS3 2.54мм; SolderOption: Norm; Price: 1; Vendor: *; Value: PLS3
R137 R138 R141 R142 R158 R201-R205 = R0805: Чип резистор 0805; Vendor: Generic; Tolerance: 1%; SolderOpton: Norm; Price: 2
  R137 R138: Value: 2к49
  R141 R142 R158 R201-R205: Value: 10 кОм
R207 R208 = R0805: as R1 on sheet input1-9; Price: 2; Value: 100 кОм
X51 = 15EDGVC-3.81-04P: Вилка  4/3.81; Vendor: Degson; Current: 8А; Voltage: 2кВ; Price: 25; Value: 15EDGVC-3.81-04P

## Sheet slave.SchDoc
size 420 x 297 mm; SheetNumber: 3; SheetTotal: 9; Обозначение документа: QFP  slave; Номер листа: 3; Общее количество листов: 9
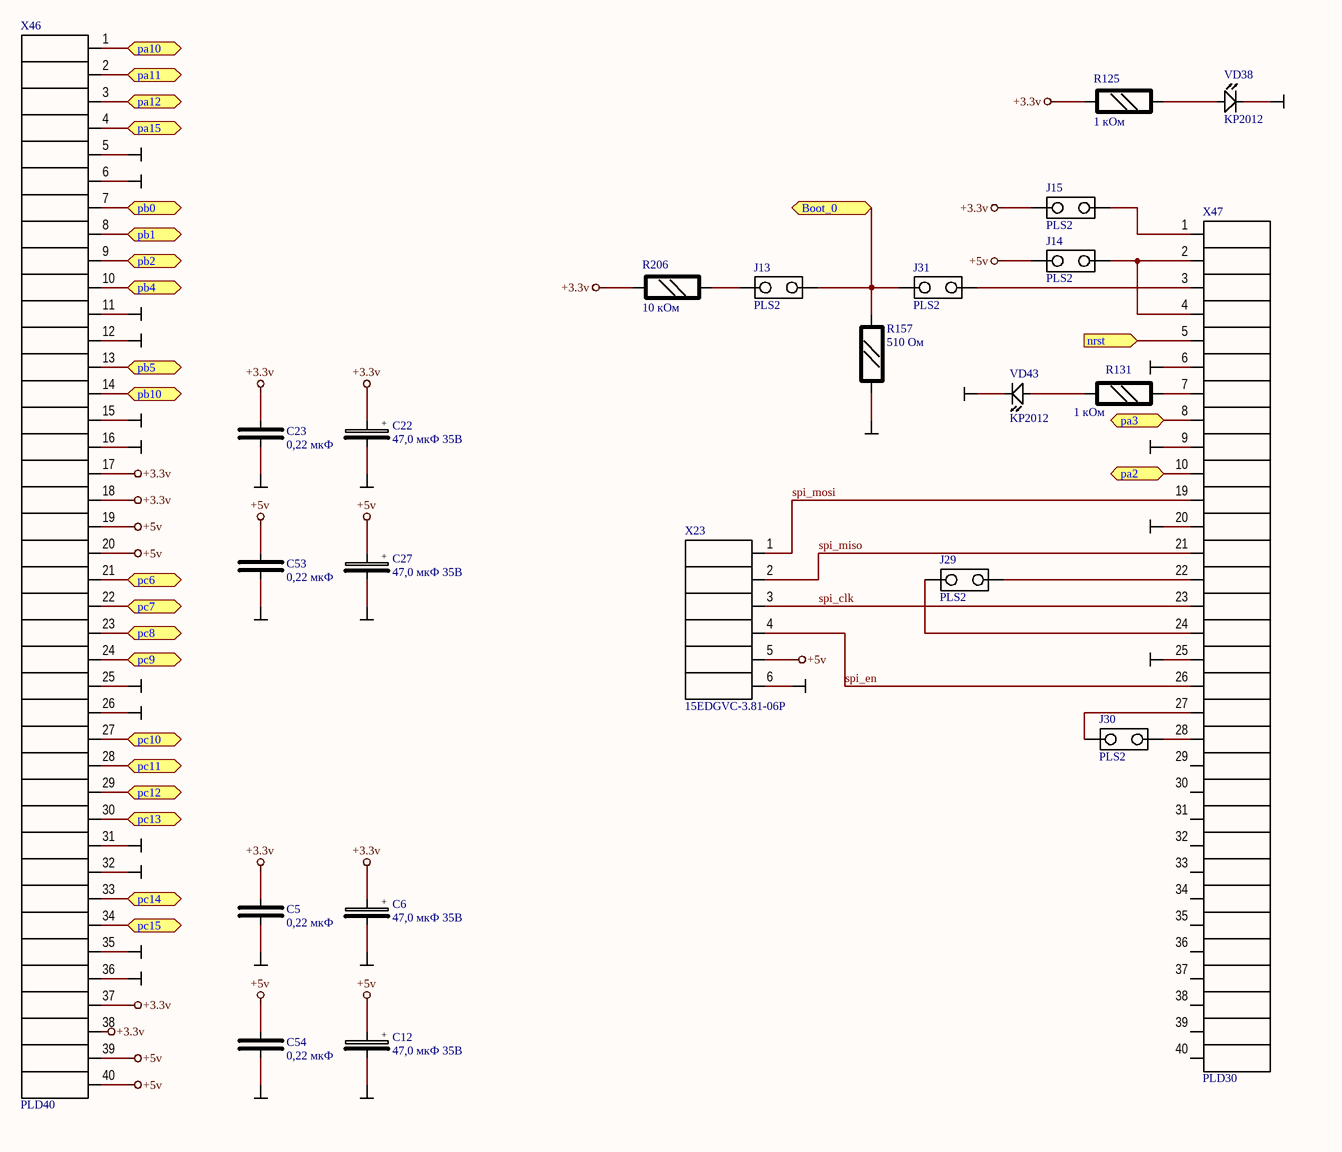
[diagram p5: slave.SchDoc]

### Parts
C5  0,22 мкФ  [SMD0805CAP]
C6  47,0 мкФ 35В  [cap6]
C12  47,0 мкФ 35В  [cap6]
C22  47,0 мкФ 35В  [cap6]
C23  0,22 мкФ  [SMD0805CAP]
C27  47,0 мкФ 35В  [cap6]
C53  0,22 мкФ  [SMD0805CAP]
C54  0,22 мкФ  [SMD0805CAP]
J13  PLS2  [PLS2]
J14  PLS2  [PLS2]
J15  PLS2  [PLS2]
J29  PLS2  [PLS2]
J30  PLS2  [PLS2]
J31  PLS2  [PLS2]
R125  1 кОм  [SMD0805RES]
R131  1 кОм  [SMD0805RES]
R157  510 Ом  [SMD0805RES]
R206  10 кОм  [SMD0805RES]
VD38  KP2012  [SMD0805DIO_C]
VD43  KP2012  [SMD0805DIO_C]
X23  15EDGVC-3.81-06P  [15EDGVC_081_6]
X46  PLD40  [PLD40_n]
X47  PLD30  [PLD40]

### Ports
nrst (in), pa2 (bidir), pa3 (bidir), pa10 (bidir), pa11 (bidir), pa12 (bidir), pa15 (bidir), pb0 (bidir), pb1 (bidir), pb2 (bidir), pb4 (bidir), pb5 (bidir), pb10 (bidir), pс6 (bidir), pс7 (bidir), pс8 (bidir), pс9 (bidir), pс10 (bidir), pс11 (bidir), pс12 (bidir), pс13 (bidir), pс14 (bidir), pс15 (bidir), Вооt_0 (bidir)

### Nets
+3.3v: C5.1 C6.1(+) C22.1(+) C23.1 J15.1 R125.2 R206.2 X46.17 X46.18 X46.37 X46.38
+5v: C12.1(+) C27.1(+) C53.1 C54.1 J14.1 X23.5 X46.19 X46.20 X46.39 X46.40
GND: C5.2 C6.2(-) C12.2(-) C22.2(-) C23.2 C27.2(-) C53.2 C54.2 R157.2 VD38.1(Cathode) VD43.1(Cathode) X23.6 X46.5 X46.6 X46.11 X46.12 X46.15 X46.16 X46.25 X46.26 X46.31 X46.32 X46.35 X46.36 X47.6 X47.9 X47.20 X47.25
nrst: X47.5 ; port nrst
spi_clk: X23.3 X47.23
spi_en: X23.4 X47.26
spi_miso: X23.2 X47.21
spi_mosi: X23.1 X47.19
NetDD8_7: X46.30 ; port pс13
NetDD8_8: X46.33 ; port pс14
NetDD8_9: X46.34 ; port pс15
NetDD8_25: X47.10 ; port pa2
NetDD8_26: X47.8 ; port pa3
NetDD8_35: X46.7 ; port pb0
NetDD8_36: X46.8 ; port pb1
NetDD8_37: X46.9 ; port pb2
NetDD8_47: X46.14 ; port pb10
NetDD8_63: X46.21 ; port pс6
NetDD8_64: X46.22 ; port pс7
NetDD8_65: X46.23 ; port pс8
NetDD8_66: X46.24 ; port pс9
NetDD8_69: X46.1 ; port pa10
NetDD8_70: X46.2 ; port pa11
NetDD8_71: X46.3 ; port pa12
NetDD8_77: X46.4 ; port pa15
NetDD8_78: X46.27 ; port pс10
NetDD8_79: X46.28 ; port pс11
NetDD8_80: X46.29 ; port pс12
NetDD8_90: X46.10 ; port pb4
NetDD8_91: X46.13 ; port pb5
NetDD8_94: J13.1 J31.2 R157.1 ; port Вооt_0
NetJ13_2: J13.2 R206.1
NetJ14_2: J14.2 X47.2 X47.4
NetJ15_2: J15.2 X47.1
NetJ29_1: J29.1 X47.24
NetJ29_2: J29.2 X47.22
NetJ30_1: J30.1 X47.27
NetJ30_2: J30.2 X47.28
NetJ31_1: J31.1 X47.3
NetR125_1: R125.1 VD38.2(Anode)
NetR131_1: R131.1 X47.7
NetR131_2: R131.2 VD43.2(Anode)

Not connected (* = marked no-connect by the designer): X47 29 30 31 32 33 34 35 36 37 38 39 40

### Notes on the sheet
- Подп. и дата
- Инв. № дубл.
- Взам. инв. №
- Инв. № подл.
- Изм.
- Лист
- № докум.
- Подп.
- Дата
- Копировал
- Формат А3

### Library data of the parts
C5 C23 C53 C54 = C0805: as C55 on sheet AnalogOut; Value: 0,22 мкФ; Price: 2
C6 C12 C22 C27 = C_e: 5мм Электролитический конденсатор; SolderOption: Norm; Value: 47,0 мкФ 35В
J13-J15 J29-J31 = PLS2: Джампер PLS2 2.54мм; SolderOption: Norm; Price: 1; Vendor: *; Value: PLS2
R125 R131 R157 R206 = R0805: as R1 on sheet input1-9; Price: 2
  R125 R131: Value: 1 кОм
  R157: Value: 510 Ом
  R206: Value: 10 кОм
VD38 VD43 = KP2012_C: as VD1 on sheet input1-9; Price: 20; Value: KP2012
X23 = 15EDGVC-3.81-06P: as X1 on sheet input1-9; Price: 50; Value: 15EDGVC-3.81-06P
X46 = PLD40: Вилка  PLD 40/2.54; Vendor: Confly; SolderOption: Norm; Price: 20; Value: PLD40
X47 = PLD30: Вилка  PLD 30/2.54; Vendor: Confly; SolderOption: Norm; Price: 20; Value: PLD30

## Sheet uc.SchDoc
size 420 x 297 mm; SheetNumber: 2; Обозначение документа: QFP uC; Номер листа: 2; Общее количество листов: 9
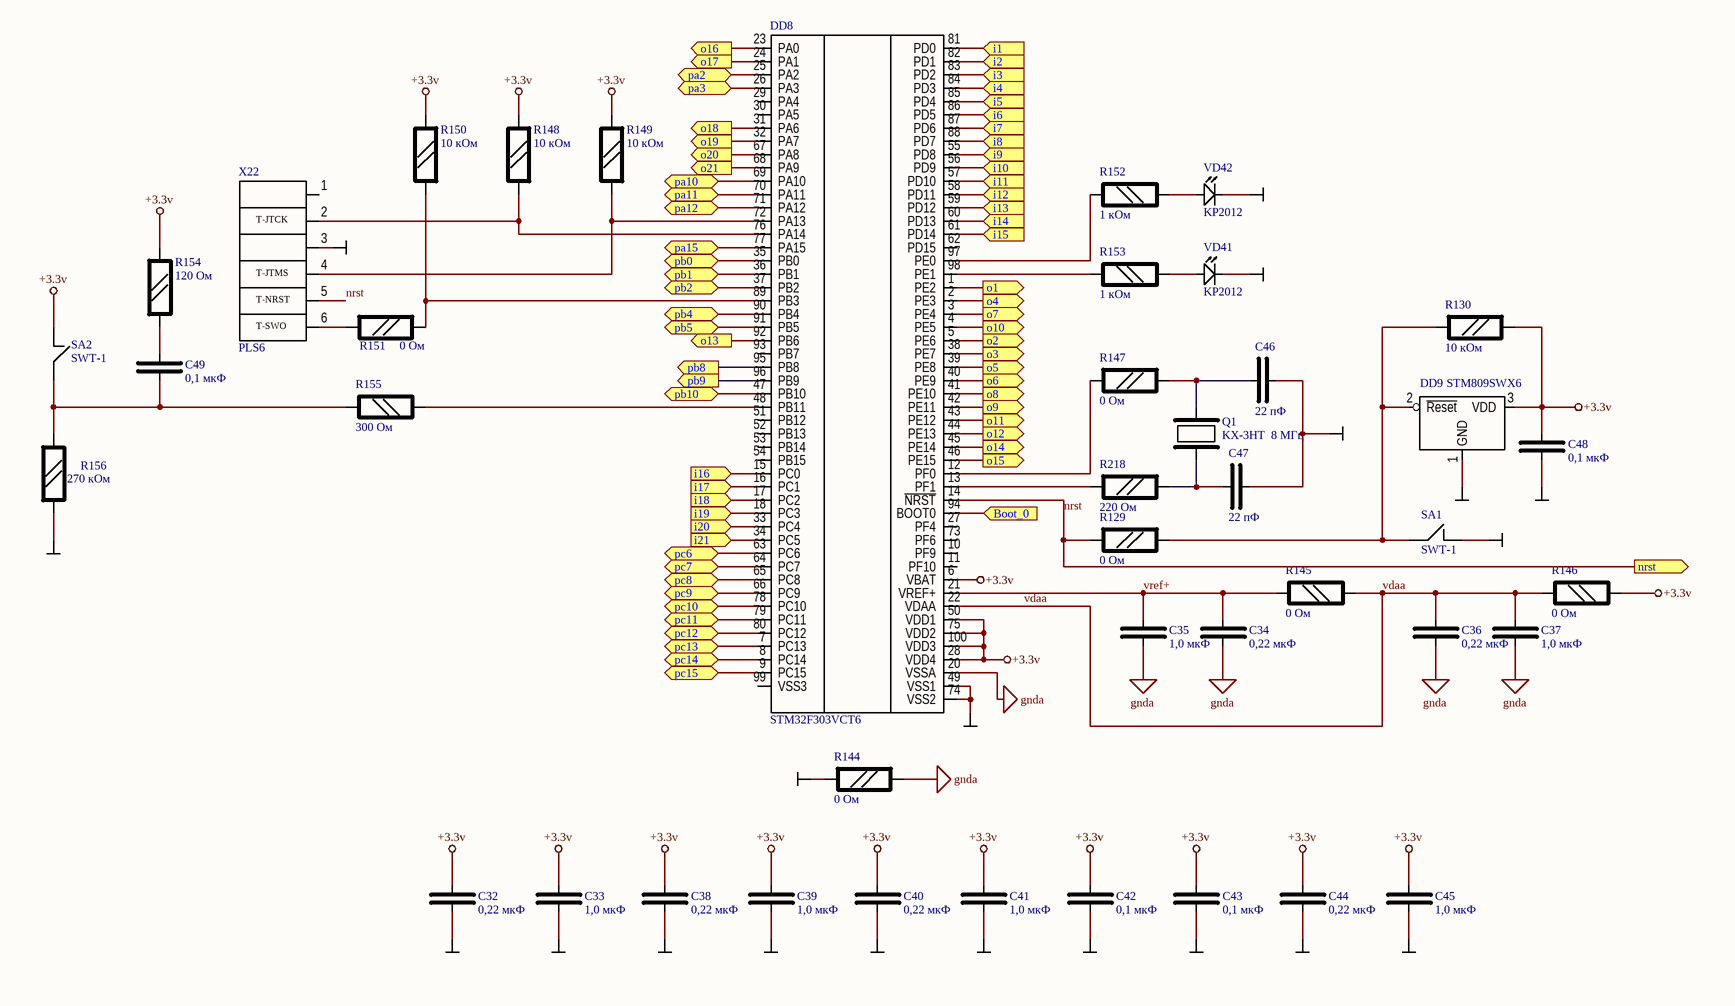
[diagram p6: uc.SchDoc]

### Parts
C32  0,22 мкФ  [SMD0805CAP]
C33  1,0 мкФ  [SMD0805CAP]
C34  0,22 мкФ  [SMD0805CAP]
C35  1,0 мкФ  [SMD0805CAP]
C36  0,22 мкФ  [SMD0805CAP]
C37  1,0 мкФ  [SMD0805CAP]
C38  0,22 мкФ  [SMD0805CAP]
C39  1,0 мкФ  [SMD0805CAP]
C40  0,22 мкФ  [SMD0805CAP]
C41  1,0 мкФ  [SMD0805CAP]
C42  0,1 мкФ  [SMD0805CAP]
C43  0,1 мкФ  [SMD0805CAP]
C44  0,22 мкФ  [SMD0805CAP]
C45  1,0 мкФ  [SMD0805CAP]
C46  22 пФ  [SMD0805CAP]
C47  22 пФ  [SMD0805CAP]
C48  0,1 мкФ  [SMD0805CAP]
C49  0,1 мкФ  [SMD0805CAP]
DD8  STM32F303VCT6  [LQFP100]
DD9  STM809SWX6  [SOT-23]
Q1  KX-3HT  8 МГц  [HC49_S]
R129  0 Ом  [SMD0805RES]
R130  10 кОм  [SMD0805RES]
R144  0 Ом  [SMD0805RES]
R145  0 Ом  [SMD0805RES]
R146  0 Ом  [SMD0805RES]
R147  0 Ом  [SMD0805RES]
R148  10 кОм  [SMD0805RES]
R149  10 кОм  [SMD0805RES]
R150  10 кОм  [SMD0805RES]
R151  0 Ом  [SMD0805RES]
R152  1 кОм  [SMD0805RES]
R153  1 кОм  [SMD0805RES]
R154  120 Ом  [SMD0805RES]
R155  300 Ом  [SMD0805RES]
R156  270 кОм  [SMD0805RES]
R218  220 Ом  [SMD0805RES]
SA1  SWT-1  [SWT-1]
SA2  SWT-1  [SWT-1]
VD41  KP2012  [SMD0805DIO_C]
VD42  KP2012  [SMD0805DIO_C]
X22  PLS6  [PLS6]

### Ports
i1 (in), i2 (in), i3 (in), i4 (in), i5 (in), i6 (in), i7 (in), i8 (in), i9 (in), i10 (in), i11 (in), i12 (in), i13 (in), i14 (in), i15 (in), i16 (in), i17 (in), i18 (in), i19 (in), i20 (in), i21 (in), nrst (out), o1 (out), o2 (out), o3 (out), o4 (out), o5 (out), o6 (out), o7 (out), o8 (out), o9 (out), o10 (out), o11 (out), o12 (out), o13 (out), o14 (out), o15 (out), o16 (out), o17 (out), o18 (out), o19 (out), o20 (out), o21 (out), pa2 (bidir), pa3 (bidir), pa10 (bidir), pa11 (bidir), pa12 (bidir), pa15 (bidir), pb0 (bidir), pb1 (bidir), pb2 (bidir), pb4 (bidir), pb5 (bidir), pb8 (out), pb9 (out), pb10 (bidir), pс6 (bidir), pс7 (bidir), pс8 (bidir), pс9 (bidir), pс10 (bidir), pс11 (bidir), pс12 (bidir), pс13 (bidir), pс14 (bidir), pс15 (bidir), Вооt_0 (in)

### Nets
+3.3v: C32.1 C33.1 C38.1 C39.1 C40.1 C41.1 C42.1 C43.1 C44.1 C45.1 C48.1 DD8.6(VBAT) DD8.28(VDD4) DD8.50(VDD1) DD8.75(VDD2) DD8.100(VDD3) DD9.3(VDD) R130.2 R146.1 R148.2 R149.2 R150.2 R154.1 SA2.2
GND: C32.2 C33.2 C38.2 C39.2 C40.2 C41.2 C42.2 C43.2 C44.2 C45.2 C46.2 C47.2 C48.2 DD8.49(VSS1) DD8.74(VSS2) DD9.1(GND) R144.1 R156.2 SA1.2 VD41.1(Cathode) VD42.1(Cathode) X22.3
gnda: C34.2 C35.2 C36.2 C37.2 DD8.20(VSSA) R144.2
nrst: DD8.14(~{NRST}) R129.1 X22.5 ; port nrst
vdaa: C36.1 C37.1 DD8.22(VDAA) R145.1 R146.2
vref+: C34.1 C35.1 DD8.21(VREF+) R145.2
NetC46_1: C46.1 Q1.1 R147.2
NetC47_1: C47.1 Q1.2 R218.2
NetC49_1: C49.1 R154.2
NetC49_2: C49.2 R155.2 R156.1 SA2.1
NetDD1_10: DD8.84(PD3) ; port i4
NetDD1_12: DD8.83(PD2) ; port i3
NetDD1_14: DD8.82(PD1) ; port i2
NetDD1_16: DD8.81(PD0) ; port i1
NetDD2_10: DD8.88(PD7) ; port i8
NetDD2_12: DD8.87(PD6) ; port i7
NetDD2_14: DD8.86(PD5) ; port i6
NetDD2_16: DD8.85(PD4) ; port i5
NetDD3_10: DD8.58(PD11) ; port i12
NetDD3_12: DD8.57(PD10) ; port i11
NetDD3_14: DD8.56(PD9) ; port i10
NetDD3_16: DD8.55(PD8) ; port i9
NetDD4_10: DD8.15(PC0) ; port i16
NetDD4_12: DD8.61(PD14) ; port i15
NetDD4_14: DD8.60(PD13) ; port i14
NetDD4_16: DD8.59(PD12) ; port i13
NetDD5_10: DD8.33(PC4) ; port i20
NetDD5_12: DD8.18(PC3) ; port i19
NetDD5_14: DD8.17(PC2) ; port i18
NetDD5_16: DD8.16(PC1) ; port i17
NetDD6_1: DD8.1(PE2) ; port o1
NetDD6_2: DD8.5(PE6) ; port o2
NetDD6_3: DD8.38(PE7) ; port o3
NetDD6_4: DD8.2(PE3) ; port o4
NetDD6_5: DD8.39(PE8) ; port o5
NetDD6_6: DD8.40(PE9) ; port o6
NetDD6_7: DD8.3(PE4) ; port o7
NetDD6_8: DD8.41(PE10) ; port o8
NetDD7_1: DD8.42(PE11) ; port o9
NetDD7_2: DD8.4(PE5) ; port o10
NetDD7_3: DD8.43(PE12) ; port o11
NetDD7_4: DD8.44(PE13) ; port o12
NetDD7_5: DD8.92(PB6) ; port o13
NetDD7_6: DD8.45(PE14) ; port o14
NetDD7_7: DD8.46(PE15) ; port o15
NetDD7_8: DD8.23(PA0) ; port o16
NetDD8_7: DD8.7(PC13) ; port pс13
NetDD8_8: DD8.8(PC14) ; port pс14
NetDD8_9: DD8.9(PC15) ; port pс15
NetDD8_12: DD8.12(PF0) R147.1
NetDD8_13: DD8.13(PF1) R218.1
NetDD8_24: DD8.24(PA1) ; port o17
NetDD8_25: DD8.25(PA2) ; port pa2
NetDD8_26: DD8.26(PA3) ; port pa3
NetDD8_31: DD8.31(PA6) ; port o18
NetDD8_32: DD8.32(PA7) ; port o19
NetDD8_34: DD8.34(PC5) ; port i21
NetDD8_35: DD8.35(PB0) ; port pb0
NetDD8_36: DD8.36(PB1) ; port pb1
NetDD8_37: DD8.37(PB2) ; port pb2
NetDD8_47: DD8.47(PB10) ; port pb10
NetDD8_48: DD8.48(PB11) R155.1
NetDD8_63: DD8.63(PC6) ; port pс6
NetDD8_64: DD8.64(PC7) ; port pс7
NetDD8_65: DD8.65(PC8) ; port pс8
NetDD8_66: DD8.66(PC9) ; port pс9
NetDD8_67: DD8.67(PA8) ; port o20
NetDD8_68: DD8.68(PA9) ; port o21
NetDD8_69: DD8.69(PA10) ; port pa10
NetDD8_70: DD8.70(PA11) ; port pa11
NetDD8_71: DD8.71(PA12) ; port pa12
NetDD8_72: DD8.72(PA13) R149.1 X22.4
NetDD8_76: DD8.76(PA14) R148.1 X22.2
NetDD8_77: DD8.77(PA15) ; port pa15
NetDD8_78: DD8.78(PC10) ; port pс10
NetDD8_79: DD8.79(PC11) ; port pс11
NetDD8_80: DD8.80(PC12) ; port pс12
NetDD8_89: DD8.89(PB3) R150.1 R151.2
NetDD8_90: DD8.90(PB4) ; port pb4
NetDD8_91: DD8.91(PB5) ; port pb5
NetDD8_94: DD8.94(BOOT0) ; port Вооt_0
NetDD8_95: DD8.95(PB8) ; port pb8
NetDD8_96: DD8.96(PB9) ; port pb9
NetDD8_97: DD8.97(PE0) R152.1
NetDD8_98: DD8.98(PE1) R153.1
NetDD9_2: DD9.2(~{Reset}) R129.2 R130.1 SA1.1
NetR151_1: R151.1 X22.6
NetR152_2: R152.2 VD42.2(Anode)
NetR153_2: R153.2 VD41.2(Anode)

Not connected (* = marked no-connect by the designer): DD8 10(PF9) 11(PF10) 27(PF4) 29(PA4) 30(PA5) 51(PB12) 52(PB13) 53(PB14) 54(PB15) 62(PD15) 73(PF6) 93(PB7) 99(VSS3); X22 1

### Notes on the sheet
- (near X22) T-JTCK
- (near X22) T-NRST
- (near X22) T-JTMS
- (near X22) T-SWO
- Подп. и дата
- Инв. № дубл.
- Взам. инв. №
- Инв. № подл.
- Изм.
- Лист
- № докум.
- Подп.
- Дата
- Копировал
- Формат А3

### Library data of the parts
C32-C45 C48 C49 = C0805: as C55 on sheet AnalogOut; Price: 2
  C32 C34 C36 C38 C40 C44: Value: 0,22 мкФ
  C33 C35 C37 C39 C41 C45: Value: 1,0 мкФ
  C42 C43 C48 C49: Value: 0,1 мкФ
C46 = C0805: Чип конденсатор 0805; Voltage: 50V; Vendor: Generic; Temp: Y5V; Tol: NPO; SolderOpton: Norm; Value: 22 пФ; Price: 2
C47 = C0805: Чип конденсатор 0805; Voltage: 50V; Vendor: Generic; Temp: Y5V; Tol: NPO; SolderOption: Norm; Value: 22 пФ; Price: 2
DD8 = STM32F303VCT6: ARM Cortex3; Vendor: STM; SolderOption: Norm; Value: STM32F303VCT6; Price: 600
DD9 = STM809SWX6: Reset генератор; Vendor: STM; Voltage: 3V3; SolderOption: Norm; Value: STM809SWX6; Price: 20
Q1 = KX-3HT: Резонатор кварцевый; Vendor: Geyer; SolderOption: Norm; Price: 50; Value: KX-3HT  8 МГц
R129 R130 R144-R147 R151-R156 R218 = R0805: as R1 on sheet input1-9; Price: 2
  R129 R144-R147 R151: Value: 0 Ом
  R130: Value: 10 кОм
  R152 R153: Value: 1 кОм
  R154: Value: 120 Ом
  R155: Value: 300 Ом
  R156: Value: 270 кОм
  R218: Value: 220 Ом
R148-R150 = R0805: as R137 on sheet AnalogOut; Price: 2; Value: 10 кОм
SA1 SA2 = SWT1: Кнопка тактовая; Vendor: KLS; Voltage: 12; SolderOption: Norm; Price: 10; Value: SWT-1
VD41 VD42 = KP2012_C: as VD1 on sheet input1-9; Price: 20; Value: KP2012
X22 = PLS6: Вилка  PLS 6x2.54; Vendor: Confly; SolderOption: Norm; Price: 5; Value: PLS6

## Sheet Power.SchDoc
size 594 x 420 mm; SheetNumber: 10; SheetTotal: 10; Обозначение документа: QFP power; Номер листа: 10; Общее количество листов: 10
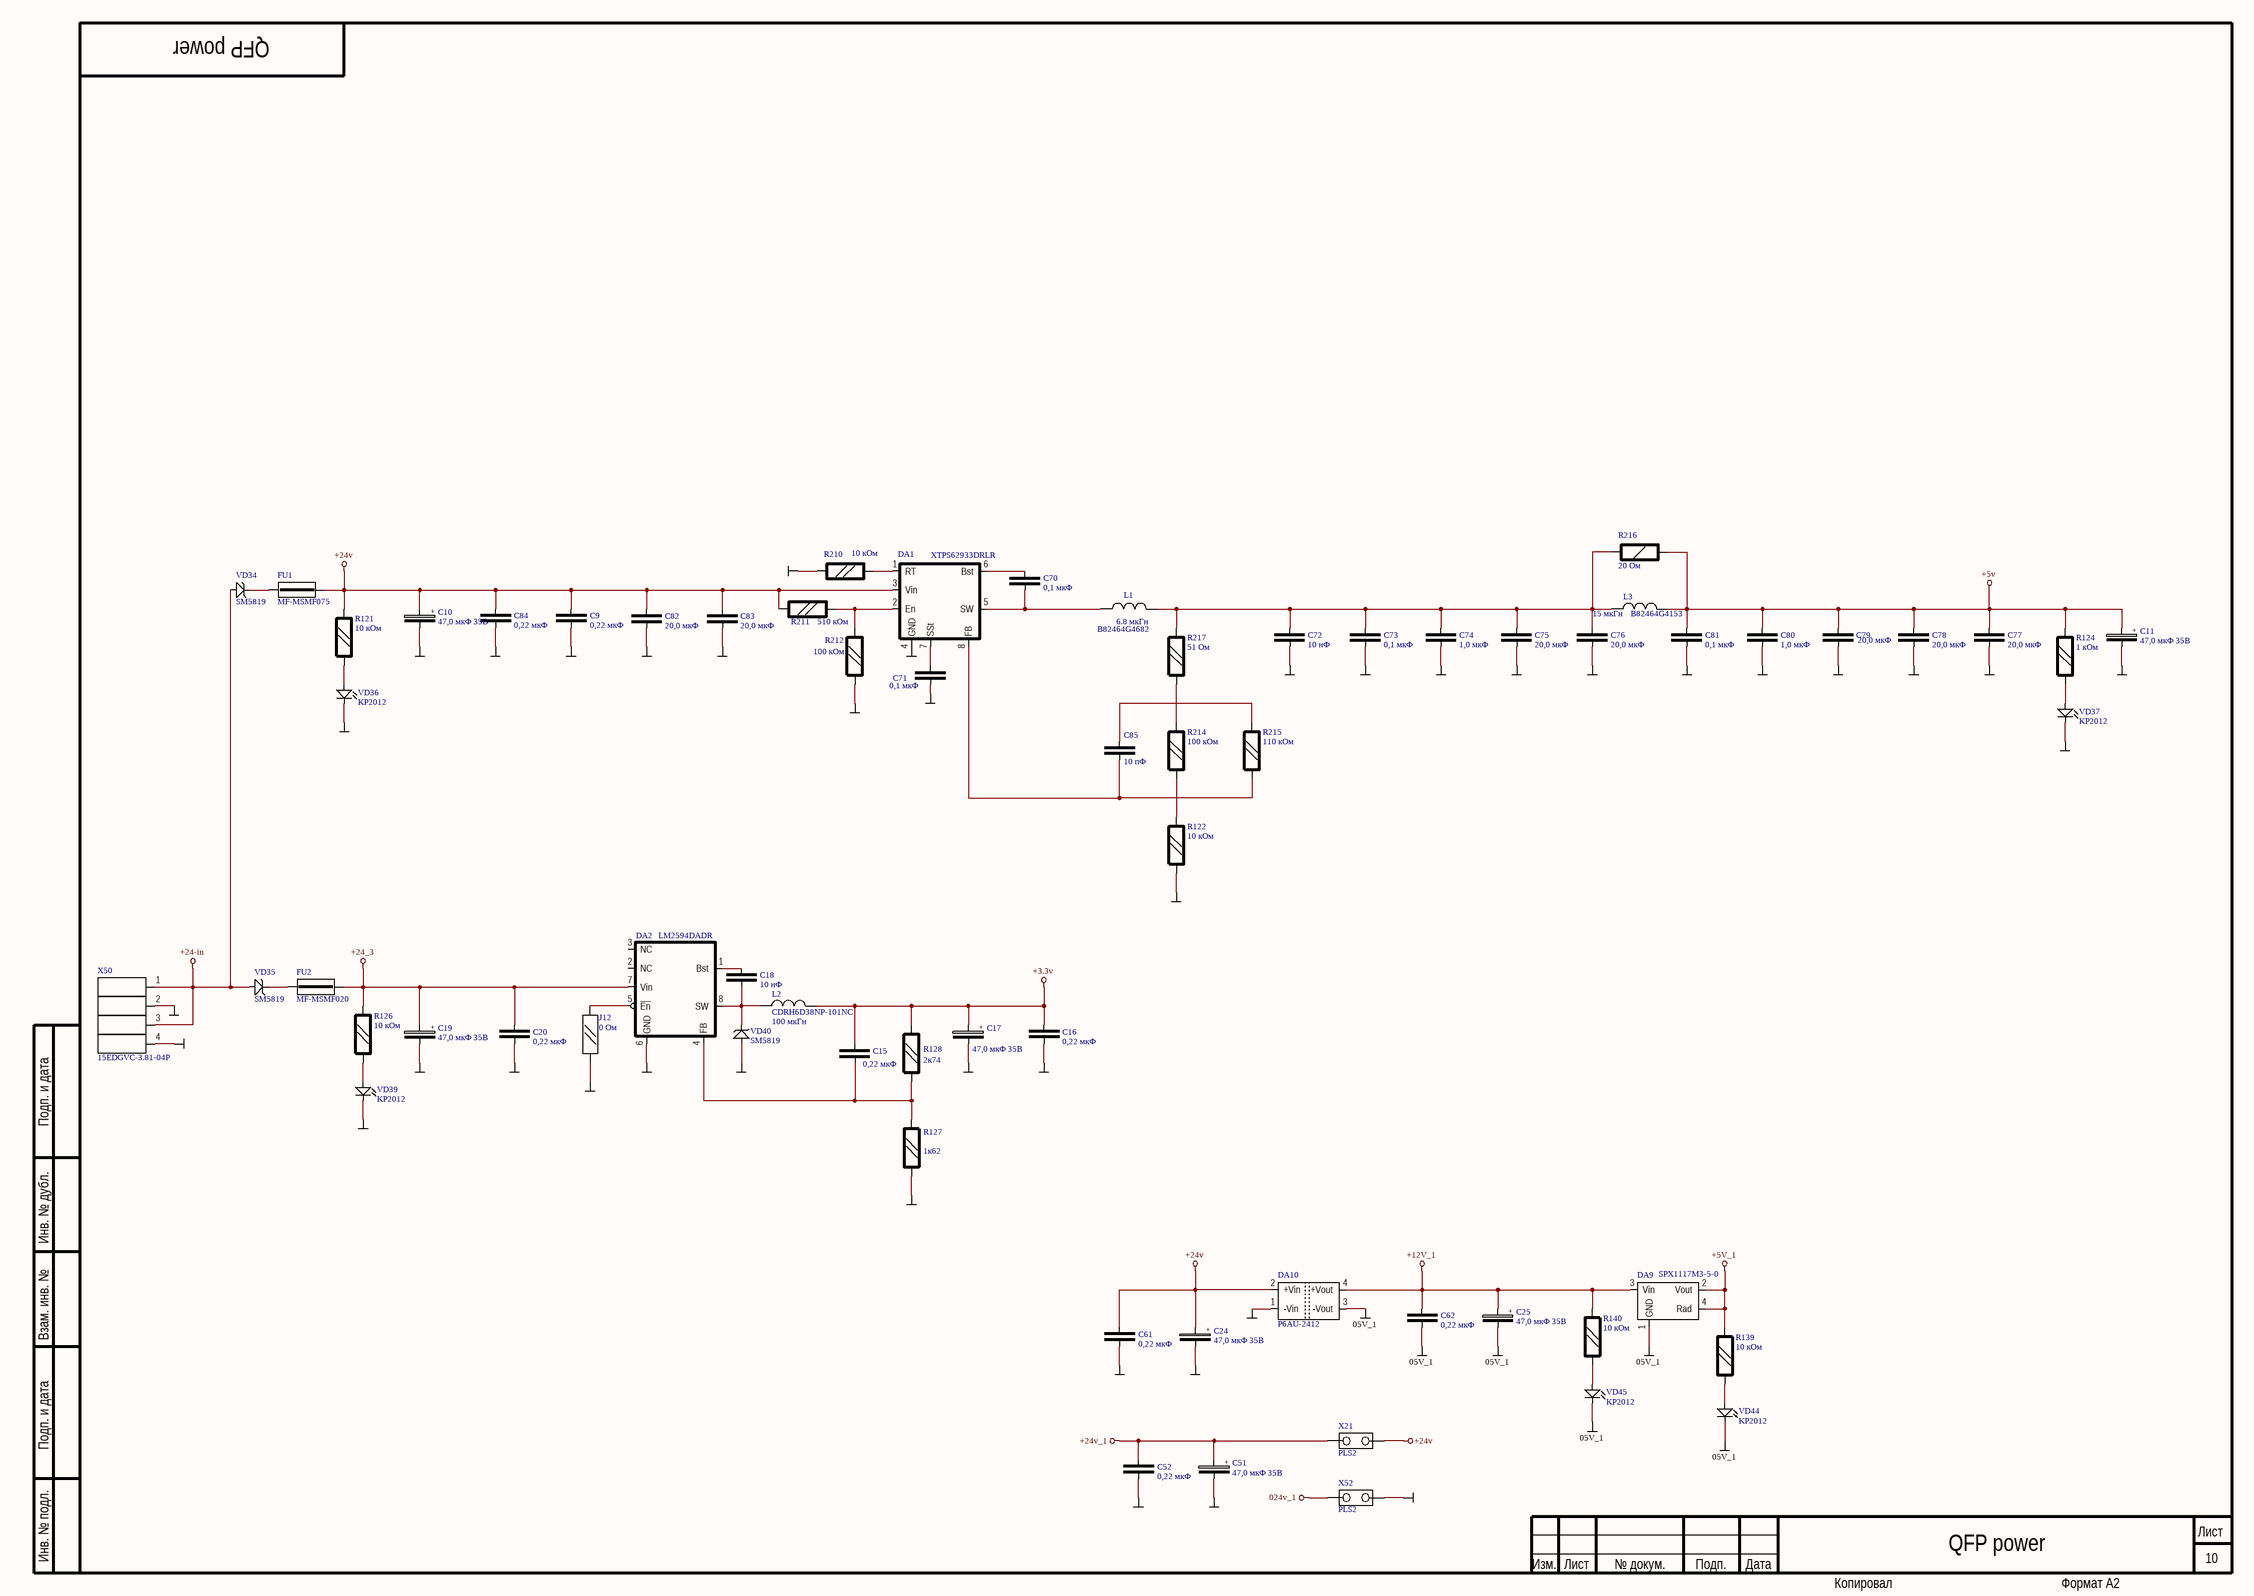
[diagram p7: Power.SchDoc]

### Parts
C9  0,22 мкФ  [RC0805]
C10  47,0 мкФ 35В  [cap6]
C11  47,0 мкФ 35В  [cap6]
C15  0,22 мкФ  [SMD0805CAP]
C16  0,22 мкФ  [RC0805]
C17  47,0 мкФ 35В  [cap6]
C18  10 нФ  [RC0805]
C19  47,0 мкФ 35В  [cap6]
C20  0,22 мкФ  [RC0805]
C24  47,0 мкФ 35В  [cap6]
C25  47,0 мкФ 35В  [cap6]
C51  47,0 мкФ 35В  [cap6]
C52  0,22 мкФ  [SMD0805CAP]
C61  0,22 мкФ  [SMD0805CAP]
C62  0,22 мкФ  [SMD0805CAP]
C70  0,1 мкФ  [SMD0805CAP]
C71  0,1 мкФ  [SMD0805CAP]
C72  10 нФ  [SMD0805CAP]
C73  0,1 мкФ  [SMD0805CAP]
C74  1,0 мкФ  [SMD0805CAP]
C75  20,0 мкФ  [CAPC1206]
C76  20,0 мкФ  [CAPC1206]
C77  20,0 мкФ  [CAPC1206]
C78  20,0 мкФ  [CAPC1206]
C79  20,0 мкФ  [CAPC1206]
C80  1,0 мкФ  [SMD0805CAP]
C81  0,1 мкФ  [SMD0805CAP]
C82  20,0 мкФ  [CAPC1206]
C83  20,0 мкФ  [CAPC1206]
C84  0,22 мкФ  [RC0805]
C85  10 пФ  [RC0805]
DA1  XTPS62933DRLR  [SOT583]
DA2  LM2594DADR  [SO8]
DA9  SPX1117M3-5-0  [SOT223]
DA10  P6AU-2412  [SiP4]
FU1  MF-MSMF075  [MSMF020]
FU2  MF-MSMF020  [MSMF020]
J12  0 Ом  [SMD0805RES]
L1  B82464G4682  Inductance: 6.8 мкГн  [IND_COILCRAFT_MSS1038]
L2  CDRH6D38NP-101NC  Inductance: 100 мкГн  [cdrh6d38np]
L3  B82464G4153  Inductance: 15 мкГн  [IND_COILCRAFT_MSS1038]
R121  10 кОм  [SMD0805RES]
R122  10 кОм  [SMD0805RES]
R124  1 кОм  [SMD0805RES]
R126  10 кОм  [SMD0805RES]
R127  1к62  [SMD0805RES]
R128  2к74  [SMD0805RES]
R139  10 кОм  [SMD0805RES]
R140  10 кОм  [SMD0805RES]
R210  10 кОм  [SMD0805RES]
R211  510 кОм  [SMD0805RES]
R212  100 кОм  [SMD0805RES]
R214  100 кОм  [SMD0805RES]
R215  110 кОм  [SMD0805RES]
R216  20 Ом  [RES1206]
R217  51 Ом  [SMD0805RES]
VD34  SM5819  [MELF]
VD35  SM5819  [MELF]
VD36  KP2012  [SMD0805DIO_C]
VD37  KP2012  [SMD0805DIO_C]
VD39  KP2012  [SMD0805DIO_C]
VD40  SM5819  [MELF]
VD44  KP2012  [SMD0805DIO_C]
VD45  KP2012  [SMD0805DIO_C]
X21  PLS2  [PLS2]
X50  15EDGVC-3.81-04P  [15EDGVC_081_4]
X52  PLS2  [PLS2]

### Nets
05V_1: C25.2(-) C62.2 DA9.1(GND) DA10.3(-Vout) VD44.1(Cathode) VD45.1(Cathode)
024v_1: X52.1
+3.3v: C15.2 C16.1 C17.1(+) L2.1 R128.2
+5v: C11.1(+) C77.2 C78.2 C79.2 C80.2 C81.2 L3.2 R124.2 R216.2
+5V_1: DA9.2(Vout) DA9.4(Rad) R139.1
+12V_1: C25.1(+) C62.1 DA9.3(Vin) DA10.4(+Vout) R140.1
+24-in: VD34.2(Anode) VD35.2(Anode) X50.1 X50.3
+24_3: C19.1(+) C20.1 DA2.7(Vin) FU2.1 R126.2
+24v: C9.1 C10.1(+) C24.1(+) C61.1 C82.2 C83.2 C84.1 DA1.3(Vin) DA10.2(+Vin) FU1.1 R121.2 R211.1 X21.2
+24v_1: C51.1(+) C52.1 X21.1
GND: C9.2 C10.2(-) C11.2(-) C16.2 C17.2(-) C19.2(-) C20.2 C24.2(-) C51.2(-) C52.2 C61.2 C71.1 C72.1 C73.1 C74.1 C75.1 C76.1 C77.1 C78.1 C79.1 C80.1 C81.1 C82.1 C83.1 C84.2 DA1.4(GND) DA2.6(GND) DA10.1(-Vin) J12.2 R122.1 R127.2 R210.1 R212.1 VD36.1(Cathode) VD37.1(Cathode) VD39.1(Cathode) VD40.2(Anode) X50.2 X50.4 X52.2
NetC15_1: C15.1 DA2.4(FB) R127.1 R128.1
NetC18_1: C18.1 DA2.1(Bst)
NetC18_2: C18.2 DA2.8(SW) L2.2 VD40.1(Cathode)
NetC70_1: C70.1 DA1.5(SW) L1.1
NetC70_2: C70.2 DA1.6(Bst)
NetC71_2: C71.2 DA1.7(SSt)
NetC72_2: C72.2 C73.2 C74.2 C75.2 C76.2 L1.2 L3.1 R216.1 R217.2
NetC85_1: C85.1 R215.2
NetC85_2: C85.2 DA1.8(FB) R215.1
NetDA1_1: DA1.1(RT) R210.2
NetDA1_2: DA1.2(En) R211.2 R212.2
NetDA2_5: DA2.5(~{En}) J12.1
NetFU1_2: FU1.2 VD34.1(Cathode)
NetFU2_2: FU2.2 VD35.1(Cathode)
NetR121_1: R121.1 VD36.2(Anode)
NetR122_2: R122.2 R214.1
NetR124_1: R124.1 VD37.2(Anode)
NetR126_1: R126.1 VD39.2(Anode)
NetR139_2: R139.2 VD44.2(Anode)
NetR140_2: R140.2 VD45.2(Anode)
NetR214_2: R214.2 R217.1

Not connected (* = marked no-connect by the designer): DA2 2(NC) 3(NC)

### Notes on the sheet
- Подп. и дата
- Инв. № дубл.
- Взам. инв. №
- Инв. № подл.
- Изм.
- Лист
- № докум.
- Подп.
- Дата
- Копировал
- Формат А2

### Library data of the parts
C9 C16 C18 C20 C84 = C0805Big: Чип конденсатор 0805; Voltage: 50V; Vendor: Generic; Temp: Y5V; Tol: 20%; SolderOptoin: Norm; Price: 2
  C9 C16 C20 C84: Value: 0,22 мкФ
  C18: Value: 10 нФ
C10 C11 C17 C19 C24 C25 C51 = C_e: as C6 on sheet slave; Value: 47,0 мкФ 35В
C15 C52 C61 C62 C70-C74 C80 C81 = C0805: as C55 on sheet AnalogOut; Price: 2
  C15 C52 C61 C62: Value: 0,22 мкФ
  C70 C71 C73 C81: Value: 0,1 мкФ
  C72: Value: 10 нФ
  C74 C80: Value: 1,0 мкФ
C75-C79 C82 C83 = C1206: Чип конденсатор 0805; Voltage: 25V; Vendor: Generic; Temp: Y5V; Tol: 20%; SolderOpton: Norm; Value: 20,0 мкФ; Price: 2; Parameter 1: *
C85 = C0805Big: Чип конденсатор 0805; Voltage: 50V; Vendor: Generic; Temp: NPO; Tol: 20%; SolderOptoin: Norm; Value: 10 пФ; Price: 2
DA1 = XTPS62933DRLR: Понижающий DC/DC конвертор; Vendor: TI; Voltage: 30V; SolderOpton: Norm; Value: XTPS62933DRLR; Price: 400
DA2 = LM2594DADR: Понижающий DC/DC конвертор; Vendor: ON Semi; Voltage: 37V; SolderOpton: Norm; Value: LM2594DADR; Price: 400
DA9 = SPX1117M3: LDO стабилизатор; Vendor: Sipex; Voltage: 20V; SolderOpton: Norm; Value: SPX1117M3-5-0; Price: 20
DA10 = P6AU: Изолированный DC-DC; Vendor: Peak Electronics; Voltage: 24V; SolderOption: Norm; Value: P6AU-2412; Price: 500
FU1 FU2 = MF-MSMF: Предохранитель самовосстанавливающийся; Vendor: Bourns; SolderOption: Norm; Price: 20
  FU1: Value: MF-MSMF075
  FU2: Value: MF-MSMF020
J12 = JR0805: SMD 0805 перемычка; SolderOption: Norm; Price: 2; Vendor: *; Value: 0 Ом
L1 L3 = B82464G4: SMD Дроссель; Vendor: TDK; Curent: 4.3A; Price: 100
  L1: Value: B82464G4682
  L3: Value: B82464G4153
L2 = CDRH6D38NP: SMD Дроссель; Vendor: Sumida; Curent: 0.5A; Price: 100; Value: CDRH6D38NP-101NC
R121 R124 R126 R139 R140 R211 R212 R217 = R0805: as R1 on sheet input1-9; Price: 2
  R121 R126 R139 R140: Value: 10 кОм
  R124: Value: 1 кОм
  R211: Value: 510 кОм
  R212: Value: 100 кОм
  R217: Value: 51 Ом
R122 R127 R128 R210 R214 R215 = R0805: as R137 on sheet AnalogOut; Price: 2
  R122 R210: Value: 10 кОм
  R127: Value: 1к62
  R128: Value: 2к74
  R214: Value: 100 кОм
  R215: Value: 110 кОм
R216 = R1206: as R3 on sheet input1-9; Price: 2; Value: 20 Ом
VD34 VD35 VD40 = SM5819: Чип шоттки диод MELF; Vendor: Diotec; Voltage: 40V; Current: 1A; SolderOption: Norm; Price: 15; Value: SM5819
VD36 VD37 VD39 VD44 VD45 = KP2012_C: as VD1 on sheet input1-9; Price: 20; Value: KP2012
X21 X52 = PLS2: Джампер PLS2 2.54мм; SolderOption: Norm; Price: 1; Vendor: *; Value: PLS2
X50 = 15EDGVC-3.81-04P: as X51 on sheet AnalogOut; Price: 25; Value: 15EDGVC-3.81-04P

## Sheet Output1-12.SchDoc
size 594 x 420 mm; SheetNumber: 7; SheetTotal: 10; Обозначение документа: QFP output1-12; Номер листа: 7; Общее количество листов: 10
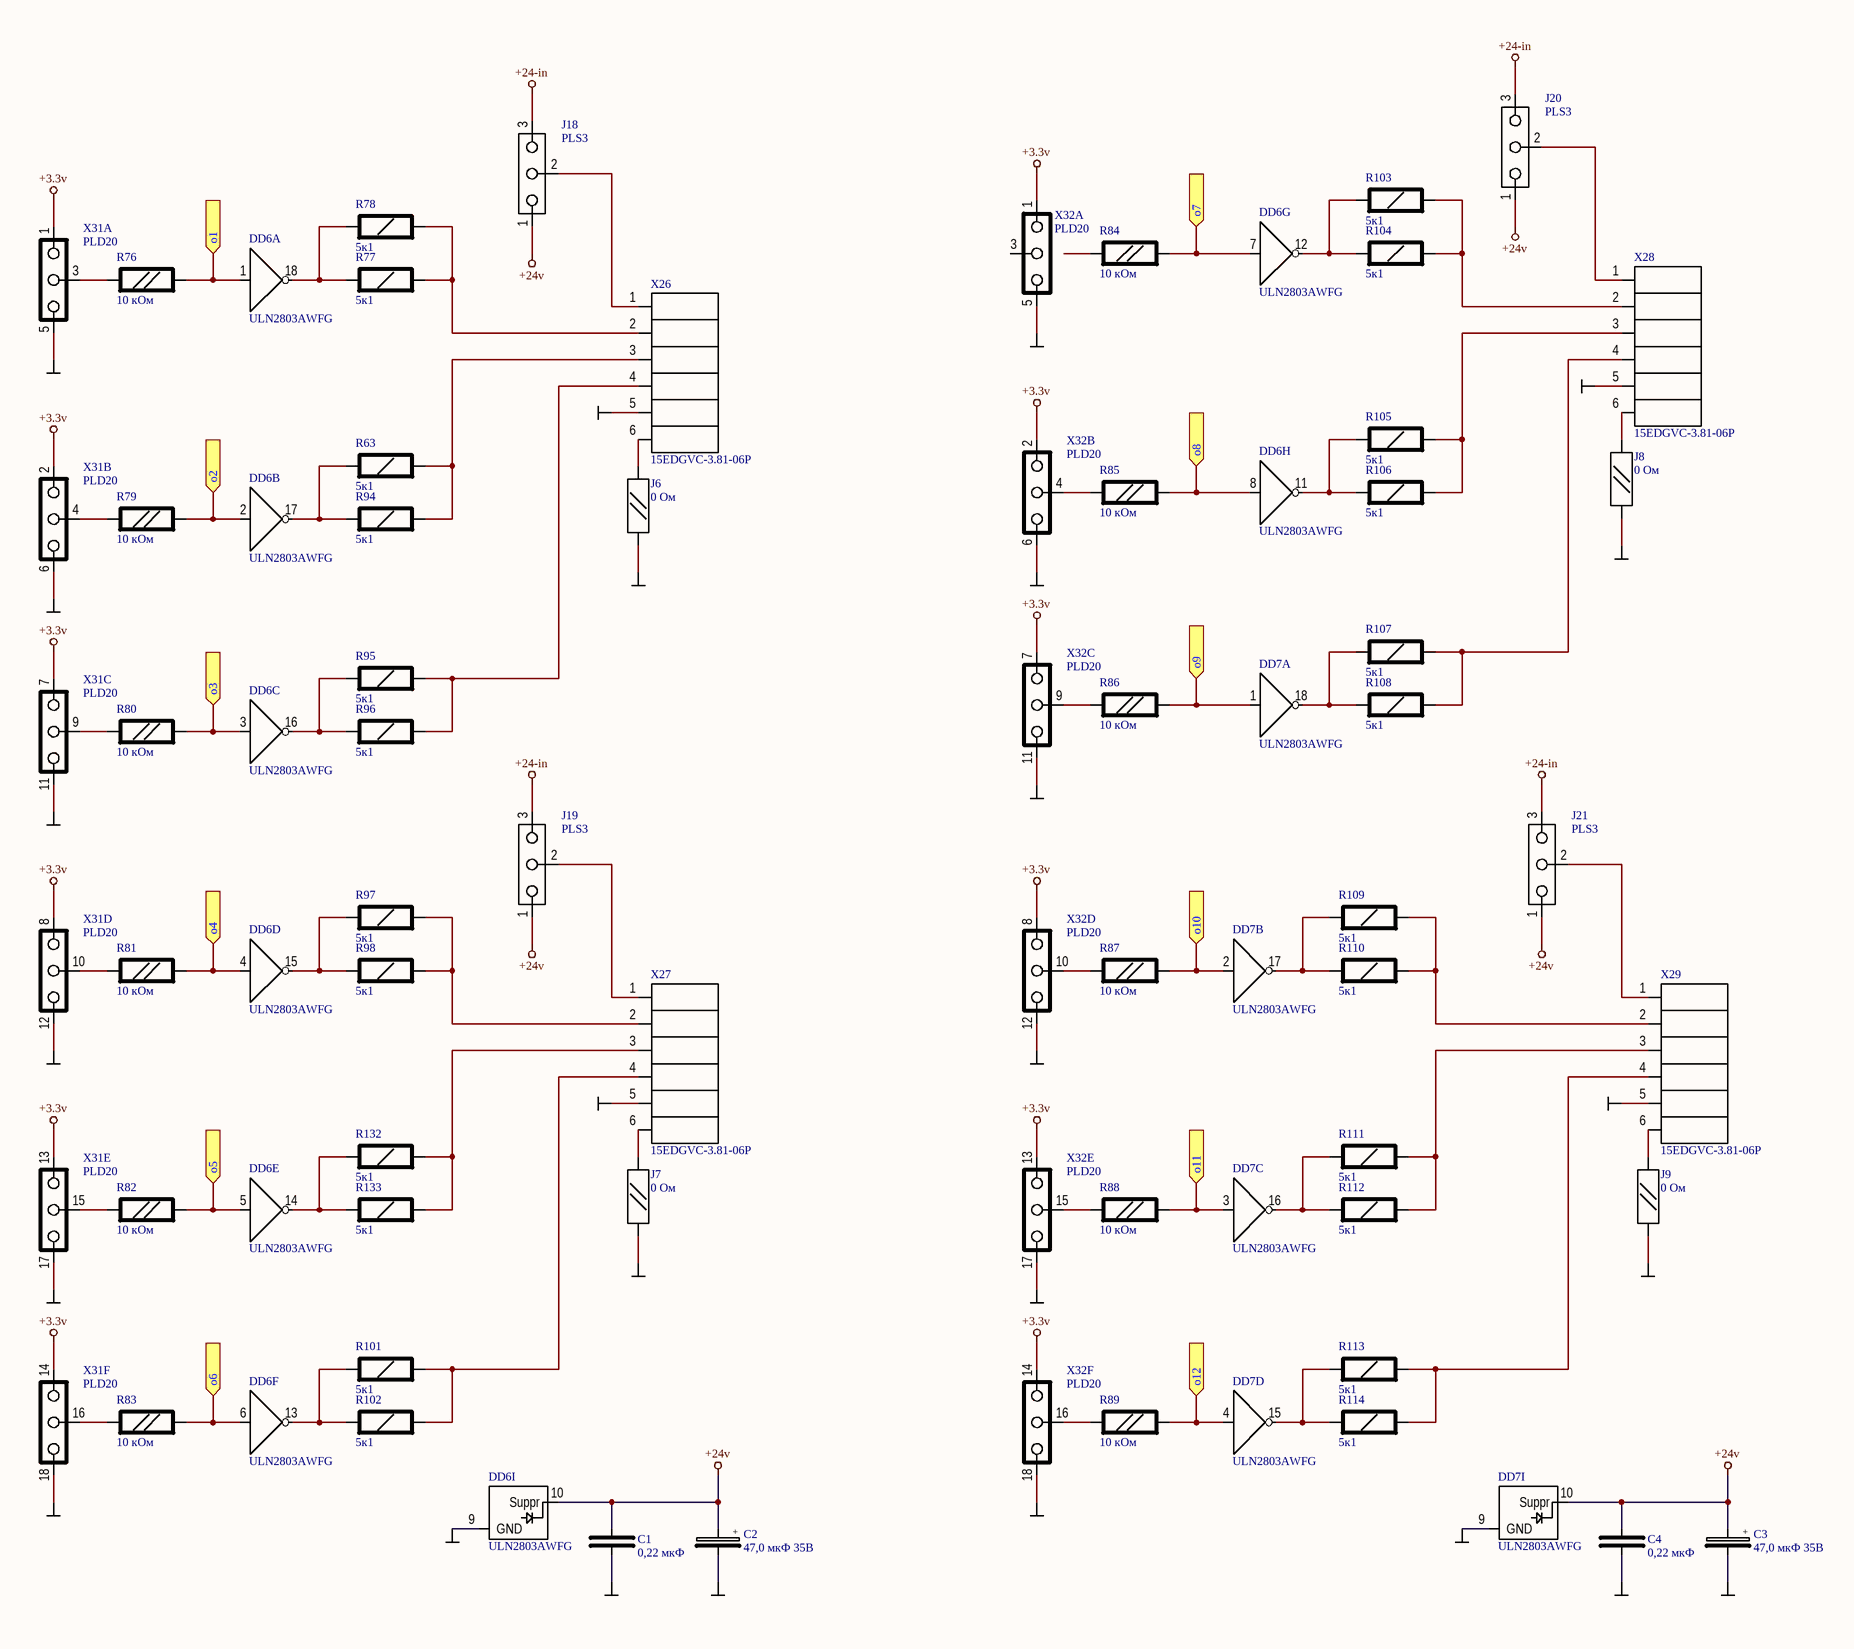
[diagram p8: Output1-12.SchDoc]

### Parts
C1  0,22 мкФ  [SMD0805CAP]
C2  47,0 мкФ 35В  [cap6]
C3  47,0 мкФ 35В  [cap6]
C4  0,22 мкФ  [SMD0805CAP]
DD6  ULN2803AWFG  [SOL18]  (parts A,B,C,D,E,F,G,H,I of 9)
DD7  ULN2803AWFG  [SOL18]  (parts A,B,C,D,I of 9)
J6  0 Ом  [SMD0805RES]
J7  0 Ом  [SMD0805RES]
J8  0 Ом  [SMD0805RES]
J9  0 Ом  [SMD0805RES]
J18  PLS3  [HDR1X3]
J19  PLS3  [HDR1X3]
J20  PLS3  [HDR1X3]
J21  PLS3  [HDR1X3]
R63  5к1  [RES1206]
R76  10 кОм  [SMD0805RES]
R77  5к1  [RES1206]
R78  5к1  [RES1206]
R79  10 кОм  [SMD0805RES]
R80  10 кОм  [SMD0805RES]
R81  10 кОм  [SMD0805RES]
R82  10 кОм  [SMD0805RES]
R83  10 кОм  [SMD0805RES]
R84  10 кОм  [SMD0805RES]
R85  10 кОм  [SMD0805RES]
R86  10 кОм  [SMD0805RES]
R87  10 кОм  [SMD0805RES]
R88  10 кОм  [SMD0805RES]
R89  10 кОм  [SMD0805RES]
R94  5к1  [RES1206]
R95  5к1  [RES1206]
R96  5к1  [RES1206]
R97  5к1  [RES1206]
R98  5к1  [RES1206]
R101  5к1  [RES1206]
R102  5к1  [RES1206]
R103  5к1  [RES1206]
R104  5к1  [RES1206]
R105  5к1  [RES1206]
R106  5к1  [RES1206]
R107  5к1  [RES1206]
R108  5к1  [RES1206]
R109  5к1  [RES1206]
R110  5к1  [RES1206]
R111  5к1  [RES1206]
R112  5к1  [RES1206]
R113  5к1  [RES1206]
R114  5к1  [RES1206]
R132  5к1  [RES1206]
R133  5к1  [RES1206]
X26  15EDGVC-3.81-06P  [15EDGVC_081_6]
X27  15EDGVC-3.81-06P  [15EDGVC_081_6]
X28  15EDGVC-3.81-06P  [15EDGVC_081_6]
X29  15EDGVC-3.81-06P  [15EDGVC_081_6]
X31  PLD20  [pld2x10_1.27]  (parts A,B,C,D,E,F of 7)
X32  PLD20  [pld2x10_1.27]  (parts A,B,C,D,E,F of 7)

### Ports
o1 (in), o2 (in), o3 (in), o4 (in), o5 (in), o6 (in), o7 (in), o8 (in), o9 (in), o10 (in), o11 (in), o12 (in)

### Nets
+3.3v: X31.1 X31.2 X31.7 X31.8 X31.13 X31.14 X32.1 X32.2 X32.7 X32.8 X32.13 X32.14
+24-in: J18.3(Left) J19.3(Left) J20.3(Left) J21.3(Left)
+24v: C1.1 C2.1(+) C3.1(+) C4.1 DD6.10(Suppr) DD7.10(Suppr) J18.1(Right) J19.1(Right) J20.1(Right) J21.1(Right)
GND: C1.2 C2.2(-) C3.2(-) C4.2 DD6.9(GND) DD7.9(GND) J6.2 J7.2 J8.2 J9.2 X26.5 X27.5 X28.5 X29.5 X31.5 X31.6 X31.11 X31.12 X31.17 X31.18 X32.5 X32.6 X32.11 X32.12 X32.17 X32.18
NetDD6_1: DD6.1(In) R76.1 ; port o1
NetDD6_2: DD6.2(In) R79.1 ; port o2
NetDD6_3: DD6.3(In) R80.1 ; port o3
NetDD6_4: DD6.4(In) R81.1 ; port o4
NetDD6_5: DD6.5(In) R82.1 ; port o5
NetDD6_6: DD6.6(In) R83.1 ; port o6
NetDD6_7: DD6.7(In) R84.1 ; port o7
NetDD6_8: DD6.8(In) R85.1 ; port o8
NetDD6_11: DD6.11(OUT) R105.2 R106.2
NetDD6_12: DD6.12(OUT) R103.2 R104.2
NetDD6_13: DD6.13(OUT) R101.2 R102.2
NetDD6_14: DD6.14(OUT) R132.2 R133.2
NetDD6_15: DD6.15(OUT) R97.2 R98.2
NetDD6_16: DD6.16(OUT) R95.2 R96.2
NetDD6_17: DD6.17(OUT) R63.2 R94.2
NetDD6_18: DD6.18(OUT) R77.2 R78.2
NetDD7_1: DD7.1(In) R86.1 ; port o9
NetDD7_2: DD7.2(In) R87.1 ; port o10
NetDD7_3: DD7.3(In) R88.1 ; port o11
NetDD7_4: DD7.4(In) R89.1 ; port o12
NetDD7_15: DD7.15(OUT) R113.2 R114.2
NetDD7_16: DD7.16(OUT) R111.2 R112.2
NetDD7_17: DD7.17(OUT) R109.2 R110.2
NetDD7_18: DD7.18(OUT) R107.2 R108.2
NetJ6_1: J6.1 X26.6
NetJ7_1: J7.1 X27.6
NetJ8_1: J8.1 X28.6
NetJ9_1: J9.1 X29.6
NetJ18_2: J18.2(Cetnter) X26.1
NetJ19_2: J19.2(Cetnter) X27.1
NetJ20_2: J20.2(Cetnter) X28.1
NetJ21_2: J21.2(Cetnter) X29.1
NetR63_1: R63.1 R94.1 X26.3
NetR76_2: R76.2 X31.3
NetR77_1: R77.1 R78.1 X26.2
NetR79_2: R79.2 X31.4
NetR80_2: R80.2 X31.9
NetR81_2: R81.2 X31.10
NetR82_2: R82.2 X31.15
NetR83_2: R83.2 X31.16
NetR85_2: R85.2 X32.4
NetR86_2: R86.2 X32.9
NetR87_2: R87.2 X32.10
NetR88_2: R88.2 X32.15
NetR89_2: R89.2 X32.16
NetR95_1: R95.1 R96.1 X26.4
NetR97_1: R97.1 R98.1 X27.2
NetR101_1: R101.1 R102.1 X27.4
NetR103_1: R103.1 R104.1 X28.2
NetR105_1: R105.1 R106.1 X28.3
NetR107_1: R107.1 R108.1 X28.4
NetR109_1: R109.1 R110.1 X29.2
NetR111_1: R111.1 R112.1 X29.3
NetR113_1: R113.1 R114.1 X29.4
NetR132_1: R132.1 R133.1 X27.3

Not connected (* = marked no-connect by the designer): R84 2; X32 3

### Notes on the sheet
- Подп. и дата
- Инв. № дубл.
- Взам. инв. №
- Инв. № подл.
- Изм.
- Лист
- № докум.
- Подп.
- Дата
- Копировал
- Формат А2

### Library data of the parts
C1 C4 = C0805: as C55 on sheet AnalogOut; Value: 0,22 мкФ; Price: 2
C2 C3 = C_e: as C6 on sheet slave; Value: 47,0 мкФ 35В
DD6 DD7 = ULN2803: Буфер 8-канальный; Vendor: Toshiba; Voltage: 50V; Bandwidth: 15MHz; SolderOption: Norm; Value: ULN2803AWFG; Price: 100
J6-J9 = JR0805: SMD 0805 перемычка; SolderOption: Norm; Price: 2; Vendor: *; Value: 0 Ом
J18-J21 = PLS3: Джампер PLS3 2.54мм; SolderOption: Norm; Price: 1; Vendor: *; Value: PLS3
R63 R77 R78 R94-R98 R101-R114 R132 R133 = R1206: as R3 on sheet input1-9; Price: 2; Value: 5к1
R76 R79-R89 = R0805: as R1 on sheet input1-9; Price: 2; Value: 10 кОм
X26-X29 = 15EDGVC-3.81-06P: as X1 on sheet input1-9; Price: 50; Value: 15EDGVC-3.81-06P
X31 X32 = PLD20: as X6 on sheet input1-9; Price: 10; Value: PLD20